# EasyEDA Pro project ProProject_OSC_Ver0.2_2023-10-09.epro

# Schematic Schematic1

## Sheets
1 Power: Create Date: 2023-09-10; Page Name: Power; Project Name: OSC_Ver0.2; Schematic Name: Schematic1; Update Date: 2023-09-19; Company: 嘉立创EDA; Page Size: A4; Version: V1.0
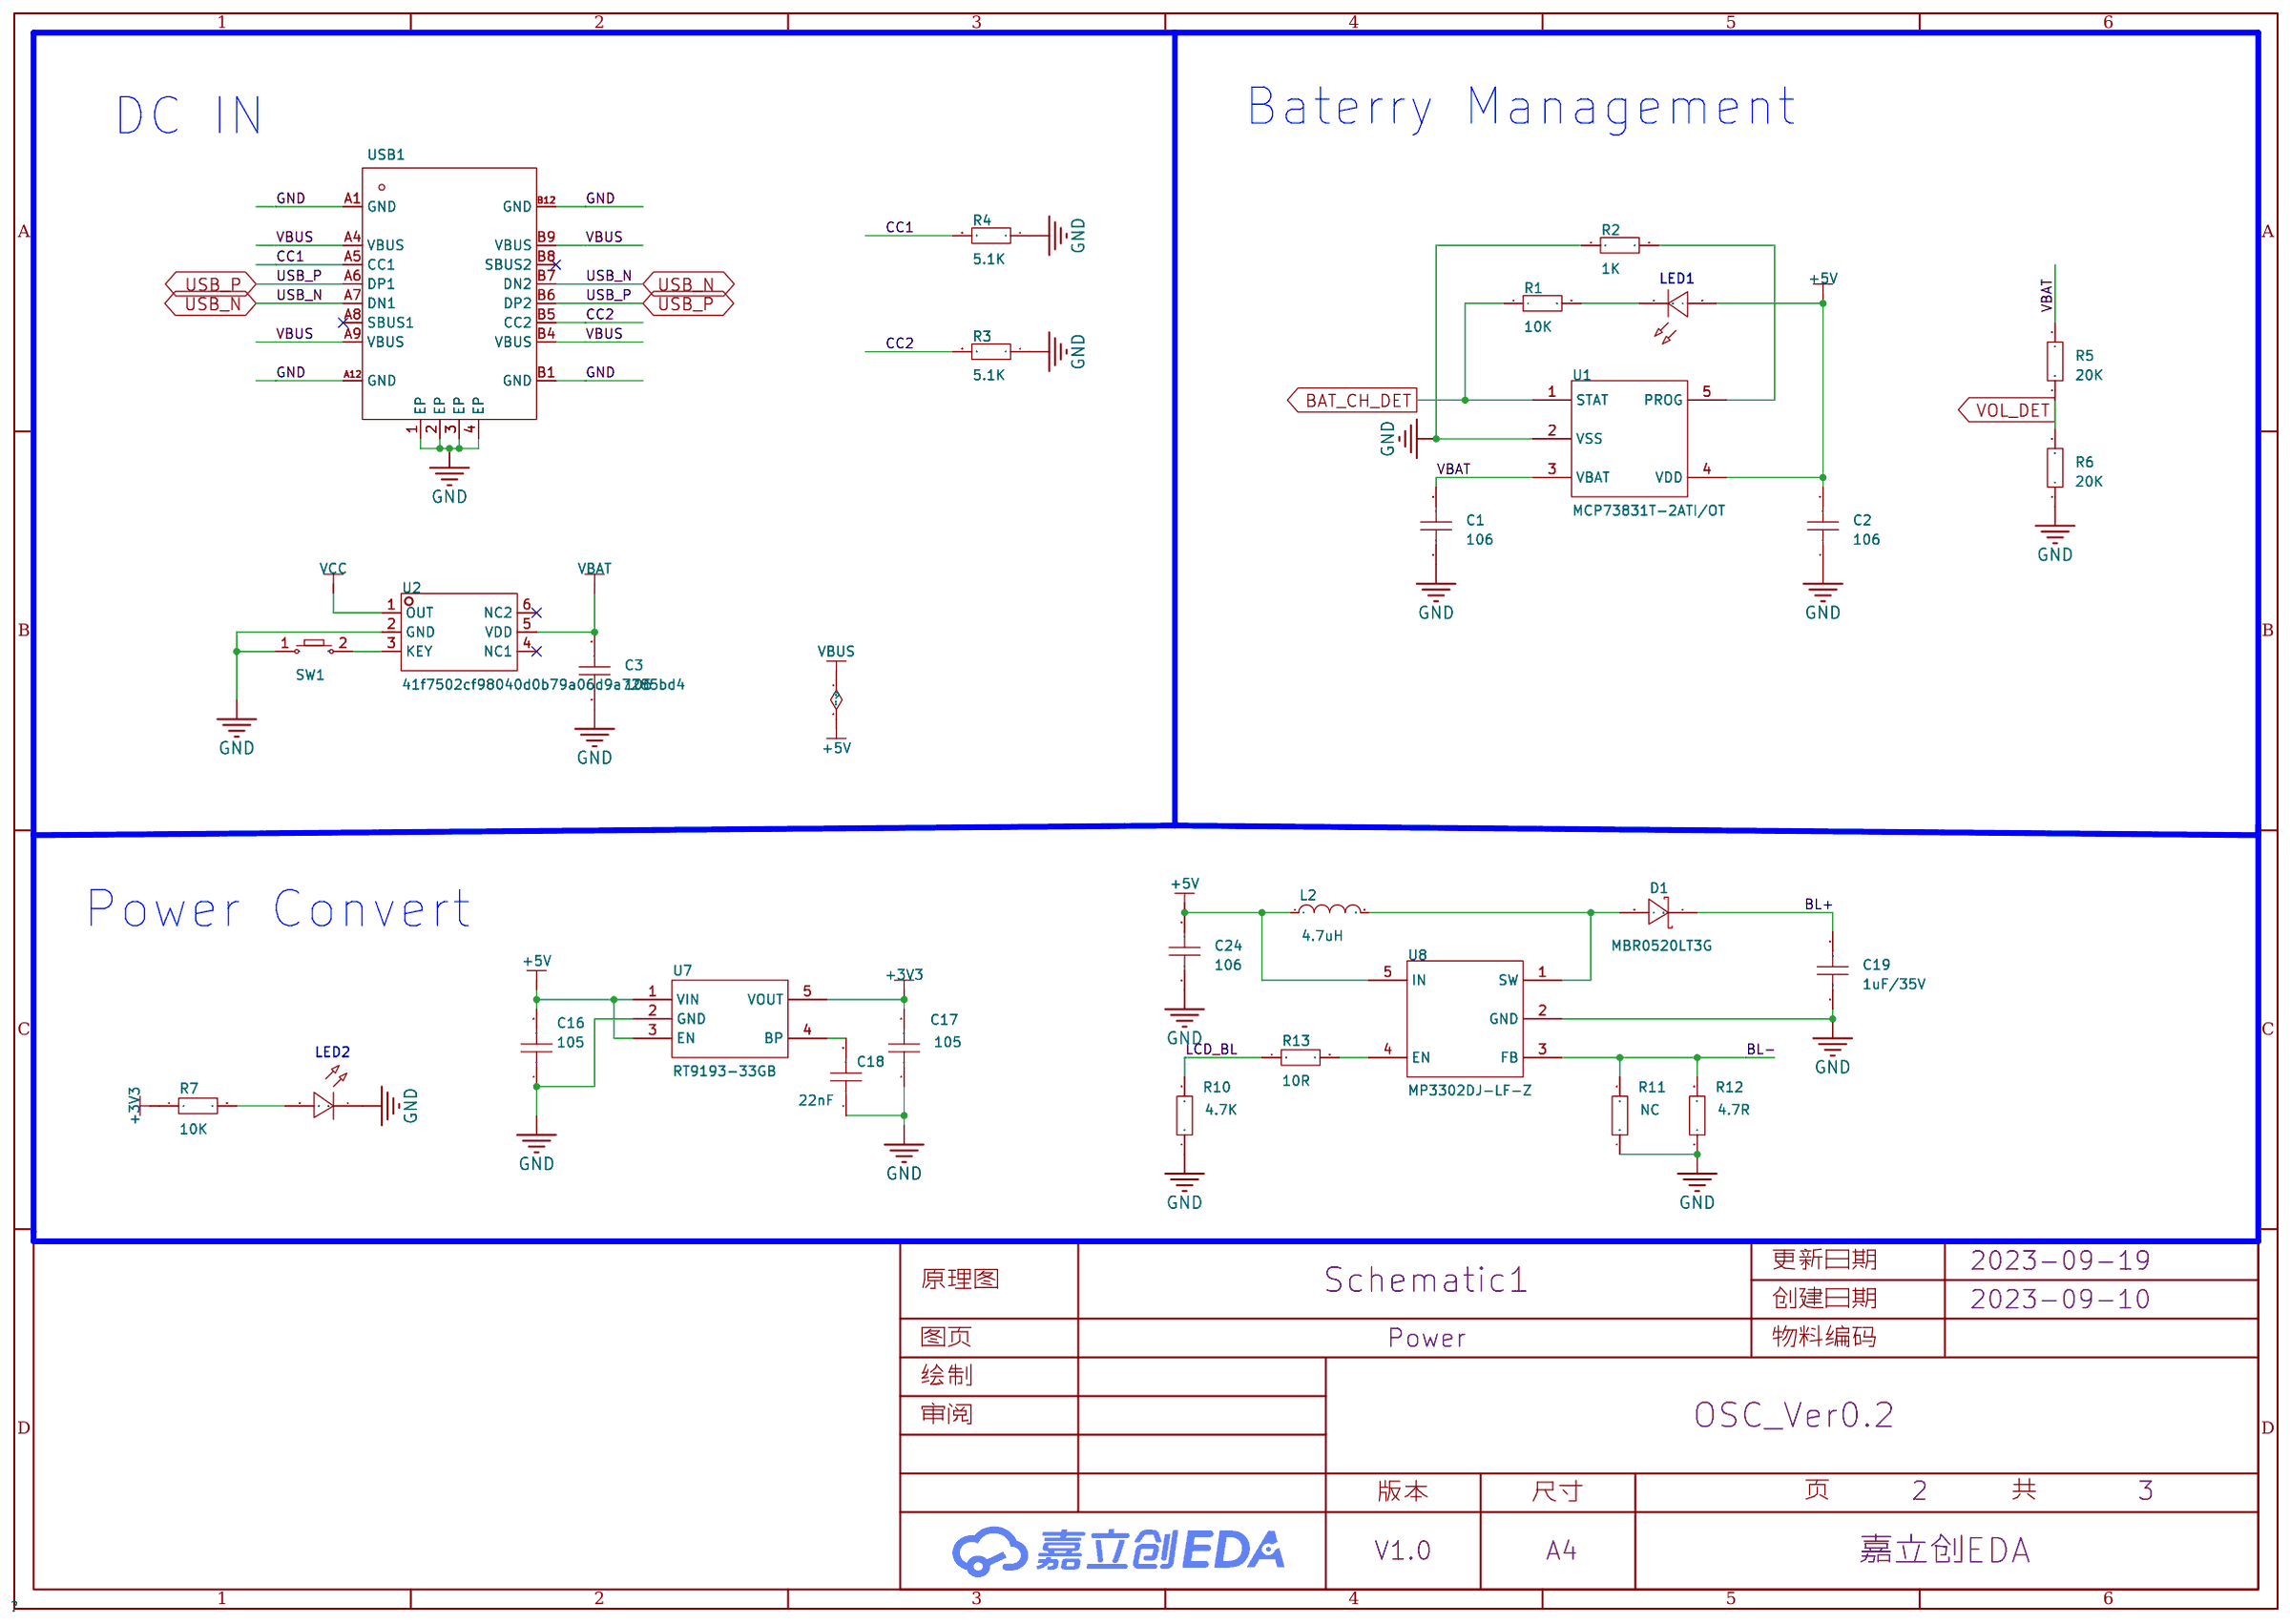
[diagram p0: Power]
2 MCU: Page Name: MCU; Update Date: 2023-10-03; Page Size: A3
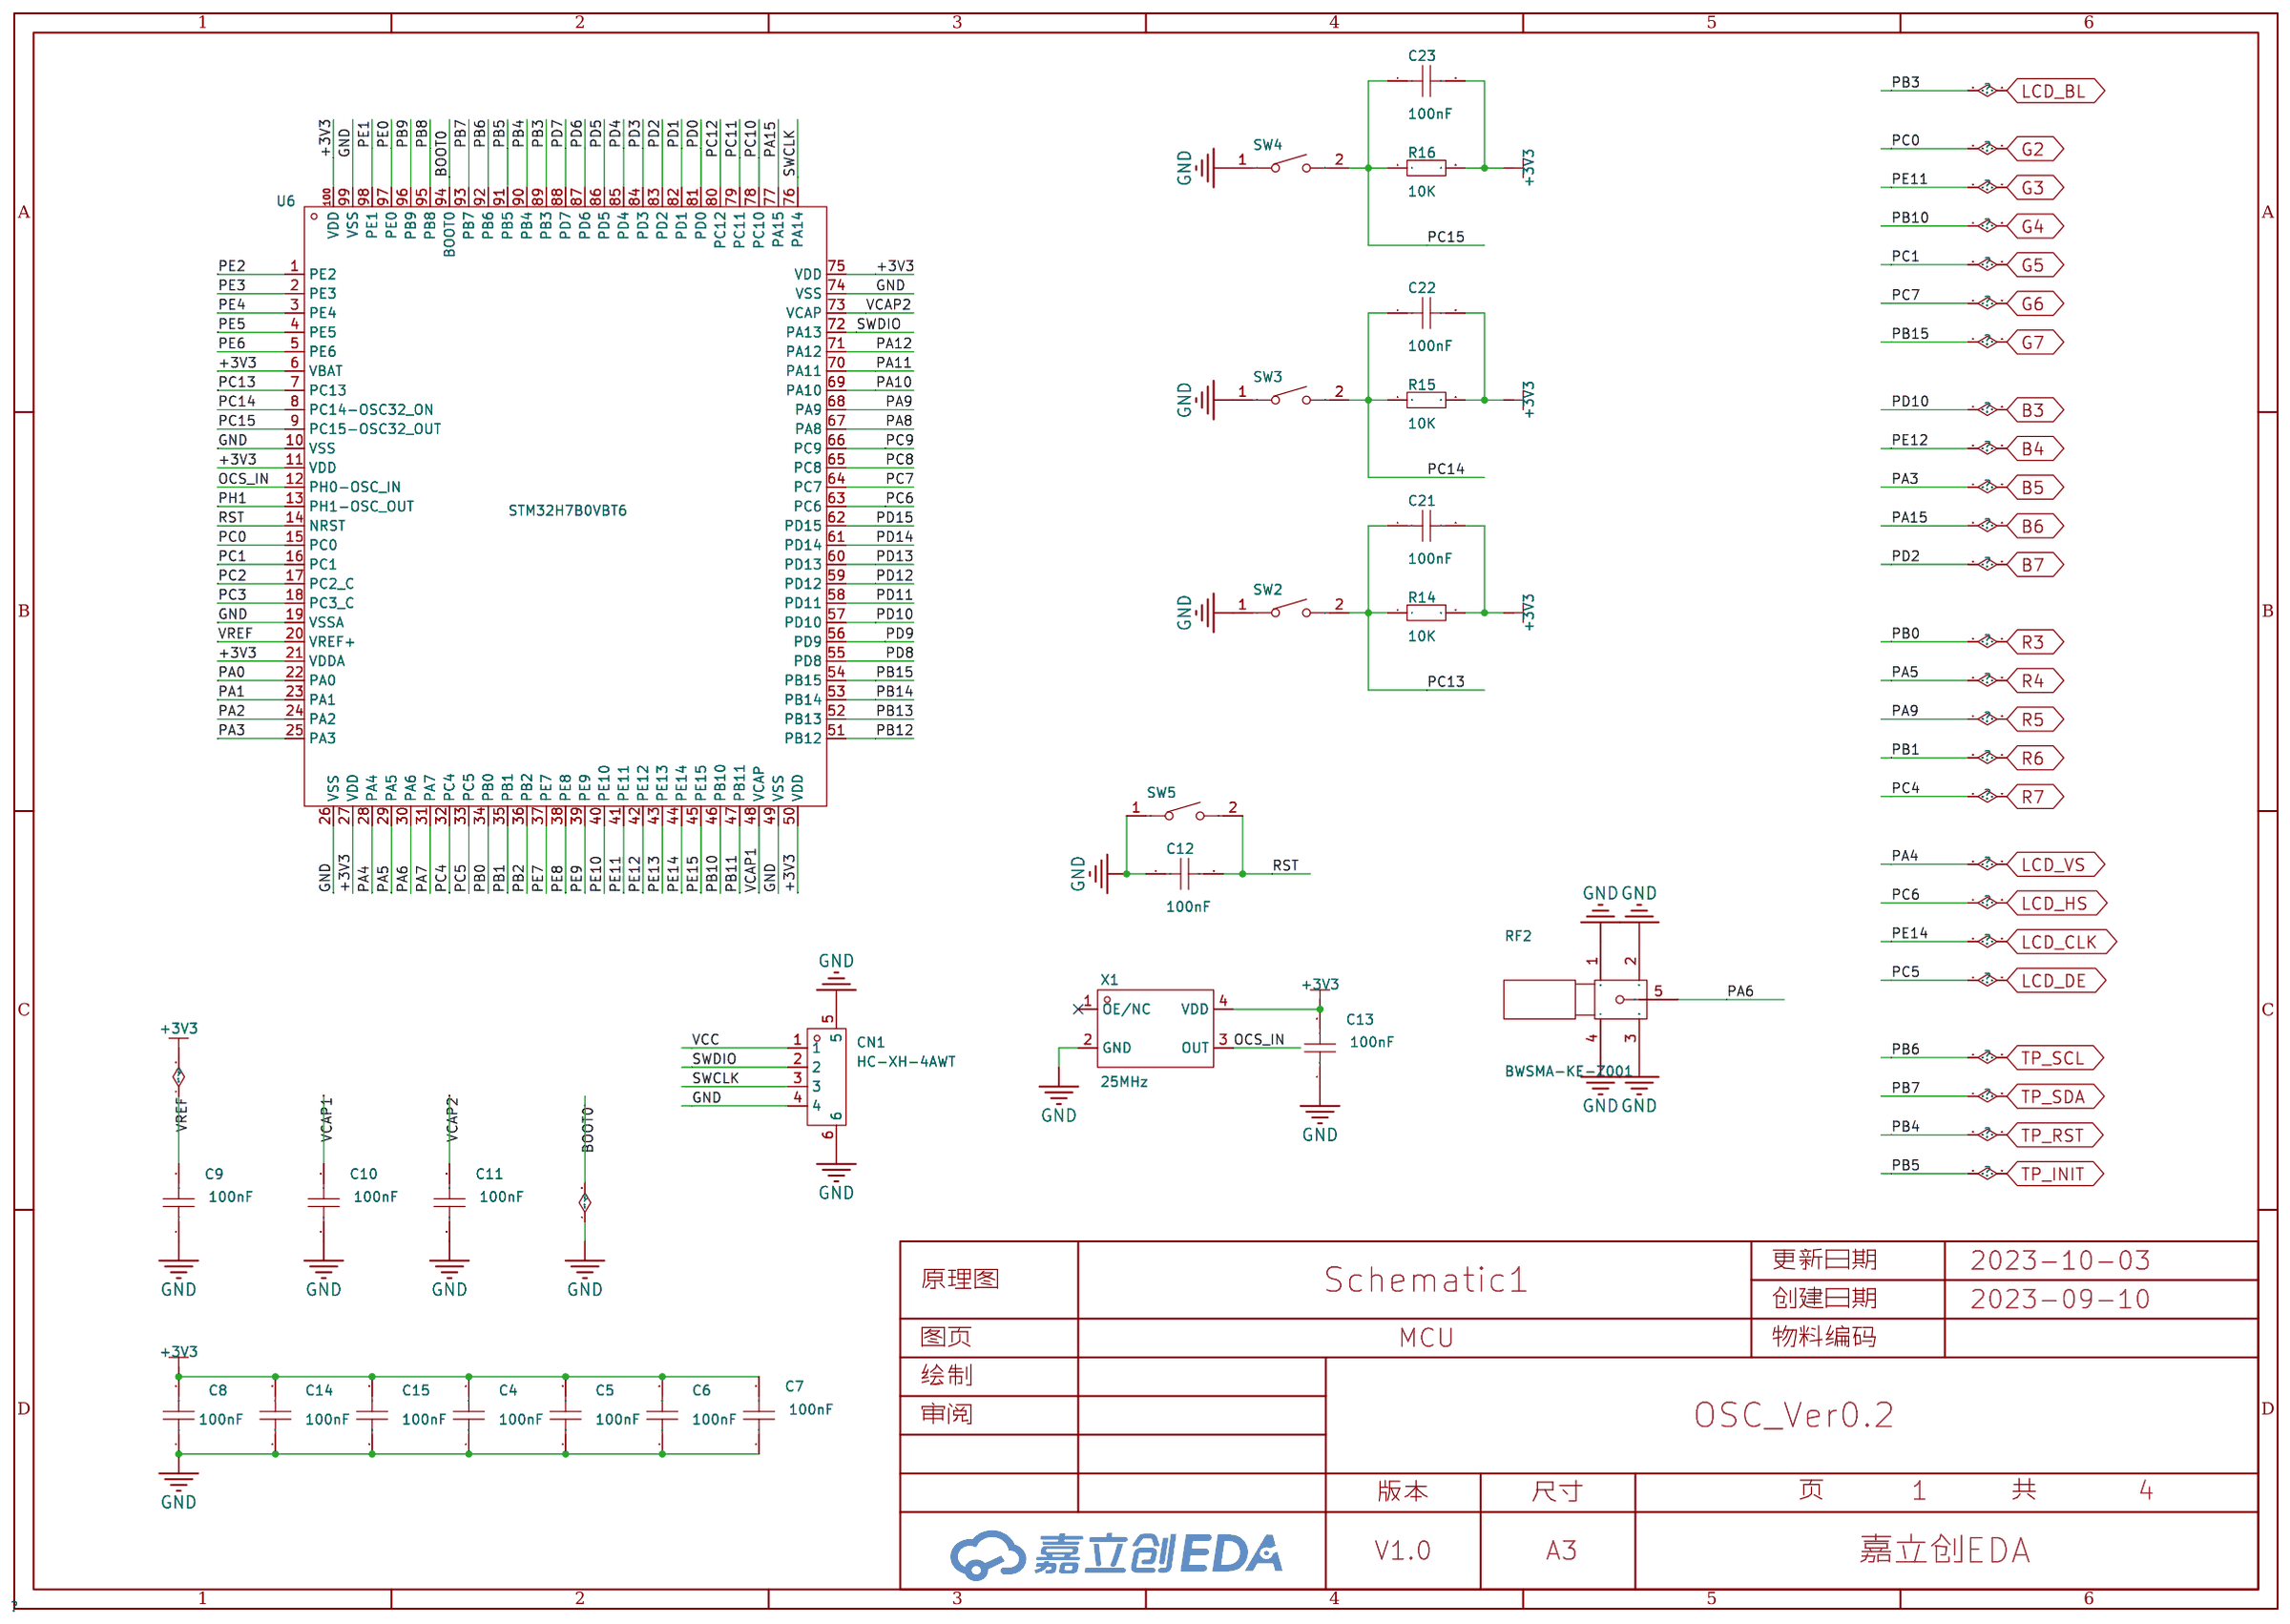
[diagram p1: MCU]
3 Screen: Create Date: 2023-09-18; Page Name: Screen; Update Date: 2023-09-18
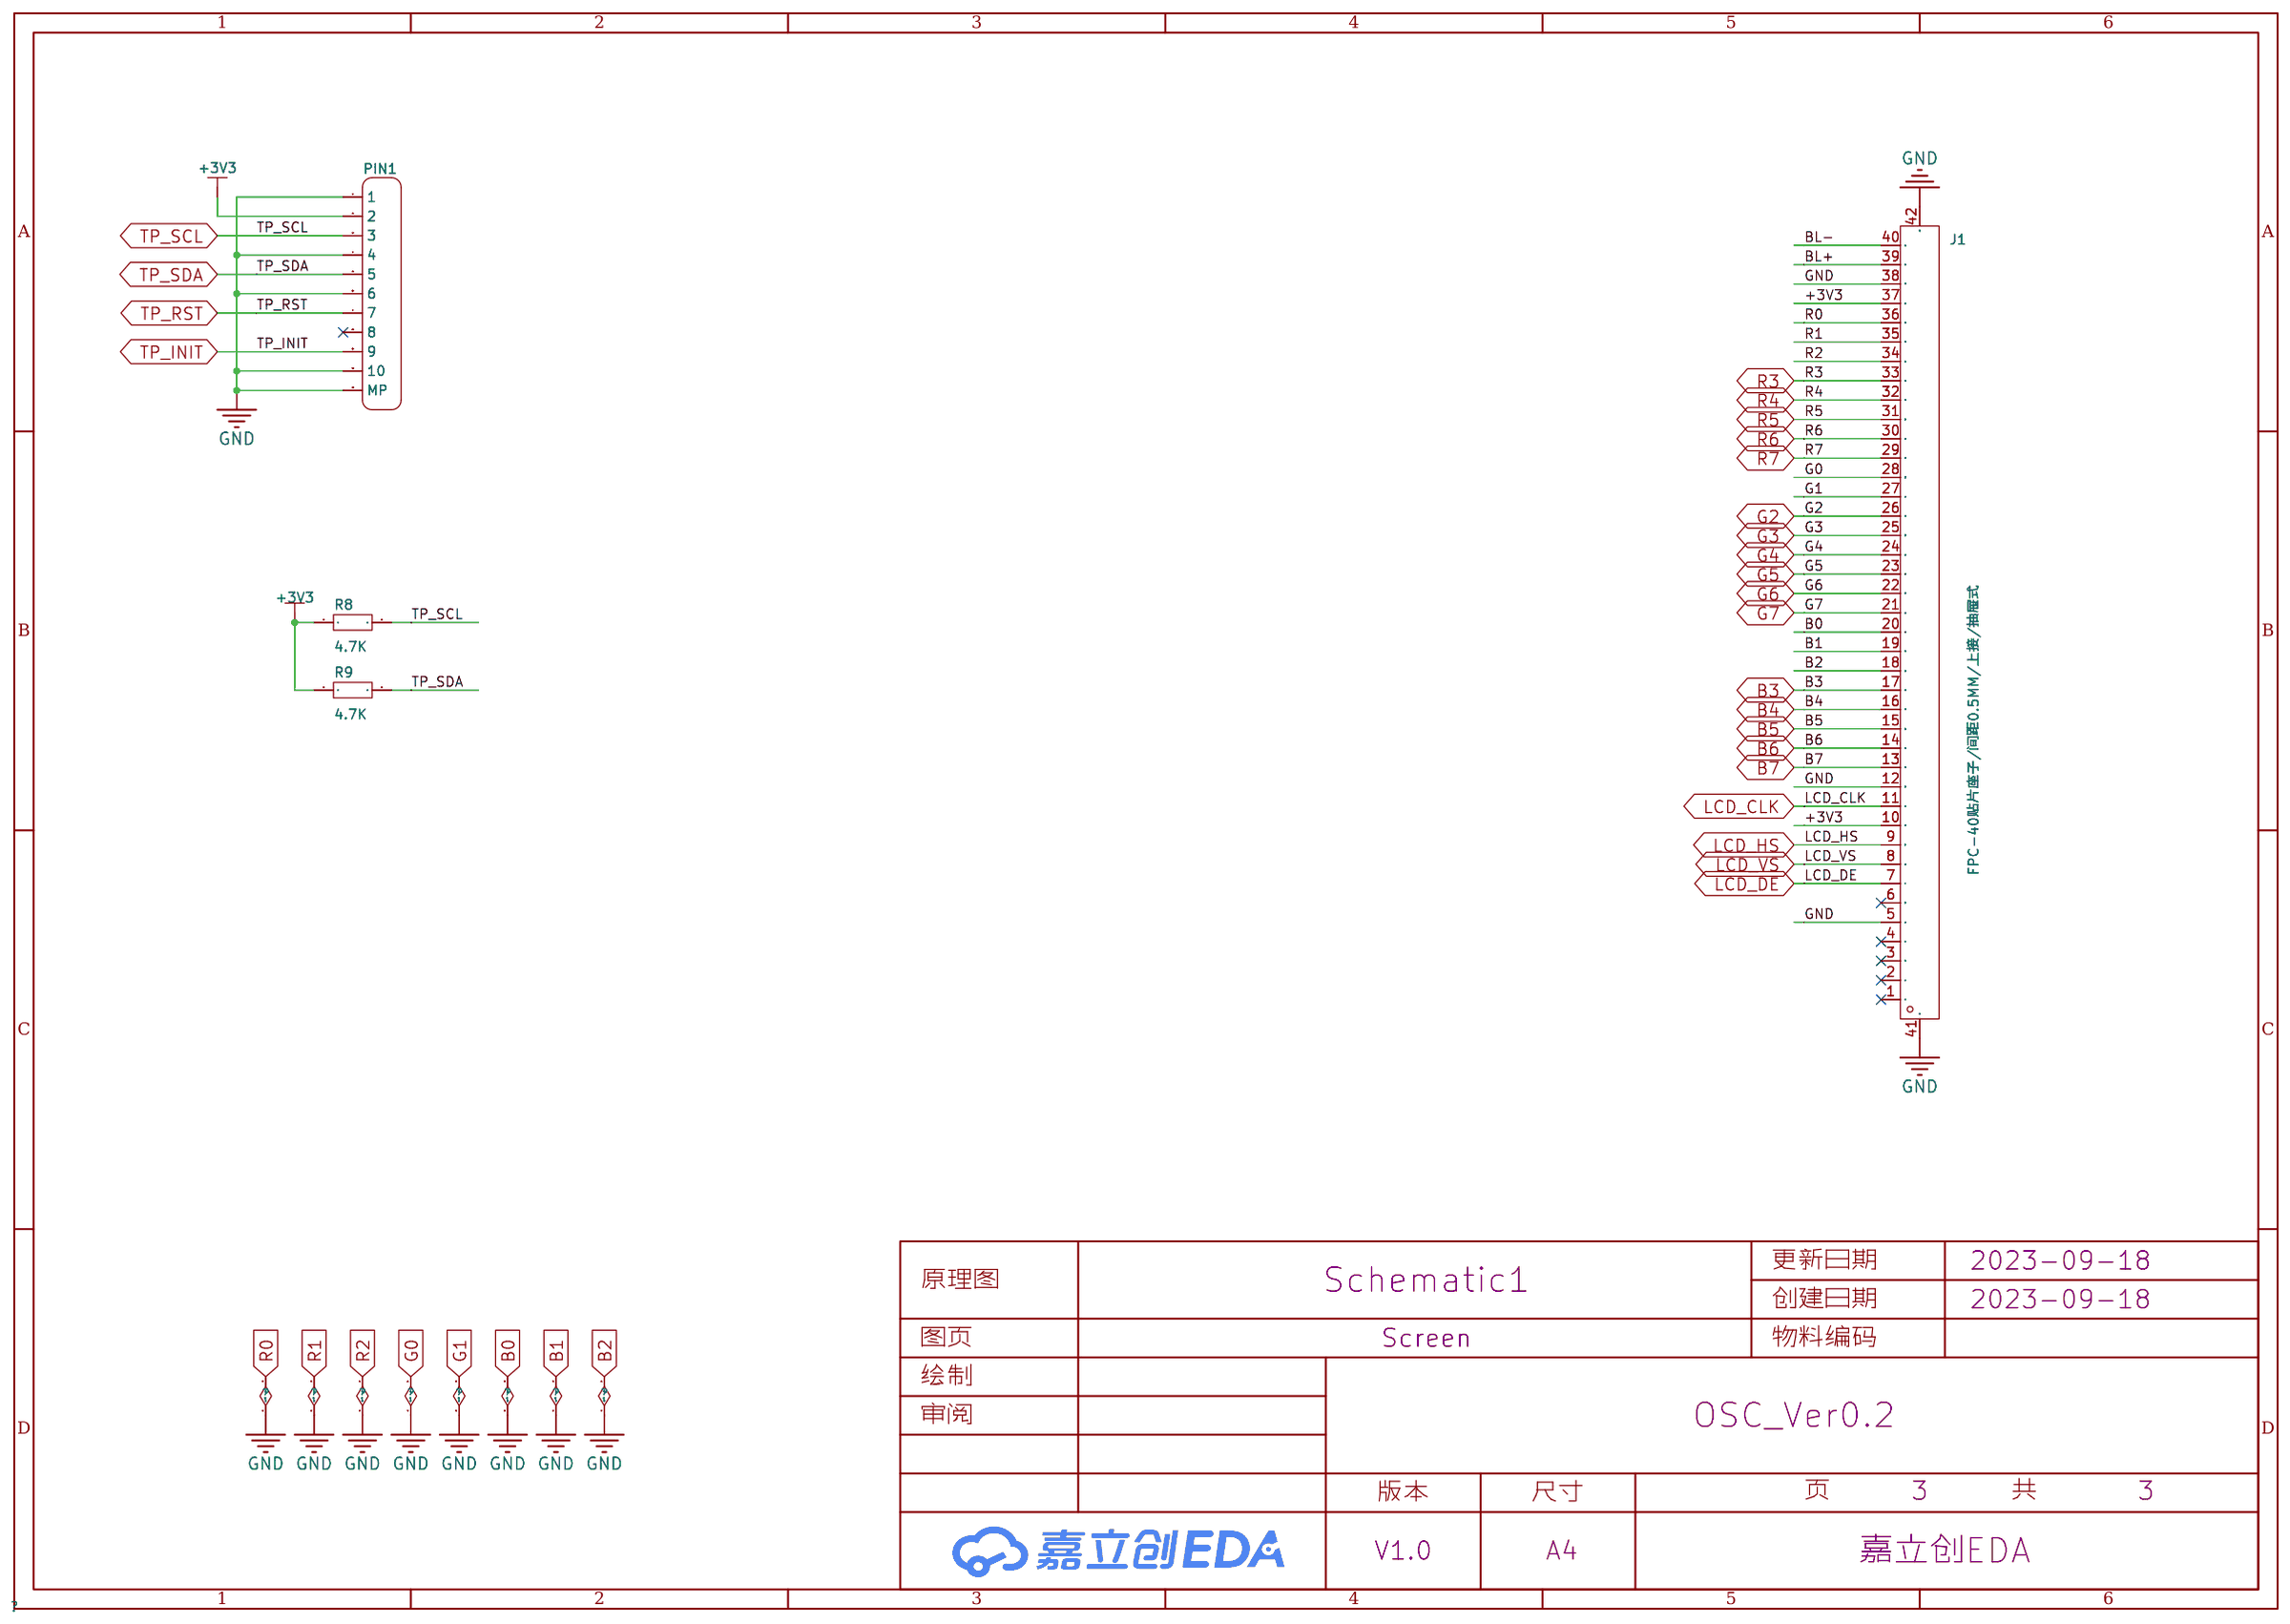
[diagram p2: Screen]
4 Analog: Create Date: 2023-10-07; Page Name: Analog.Schematic1; Update Date: 2023-10-07
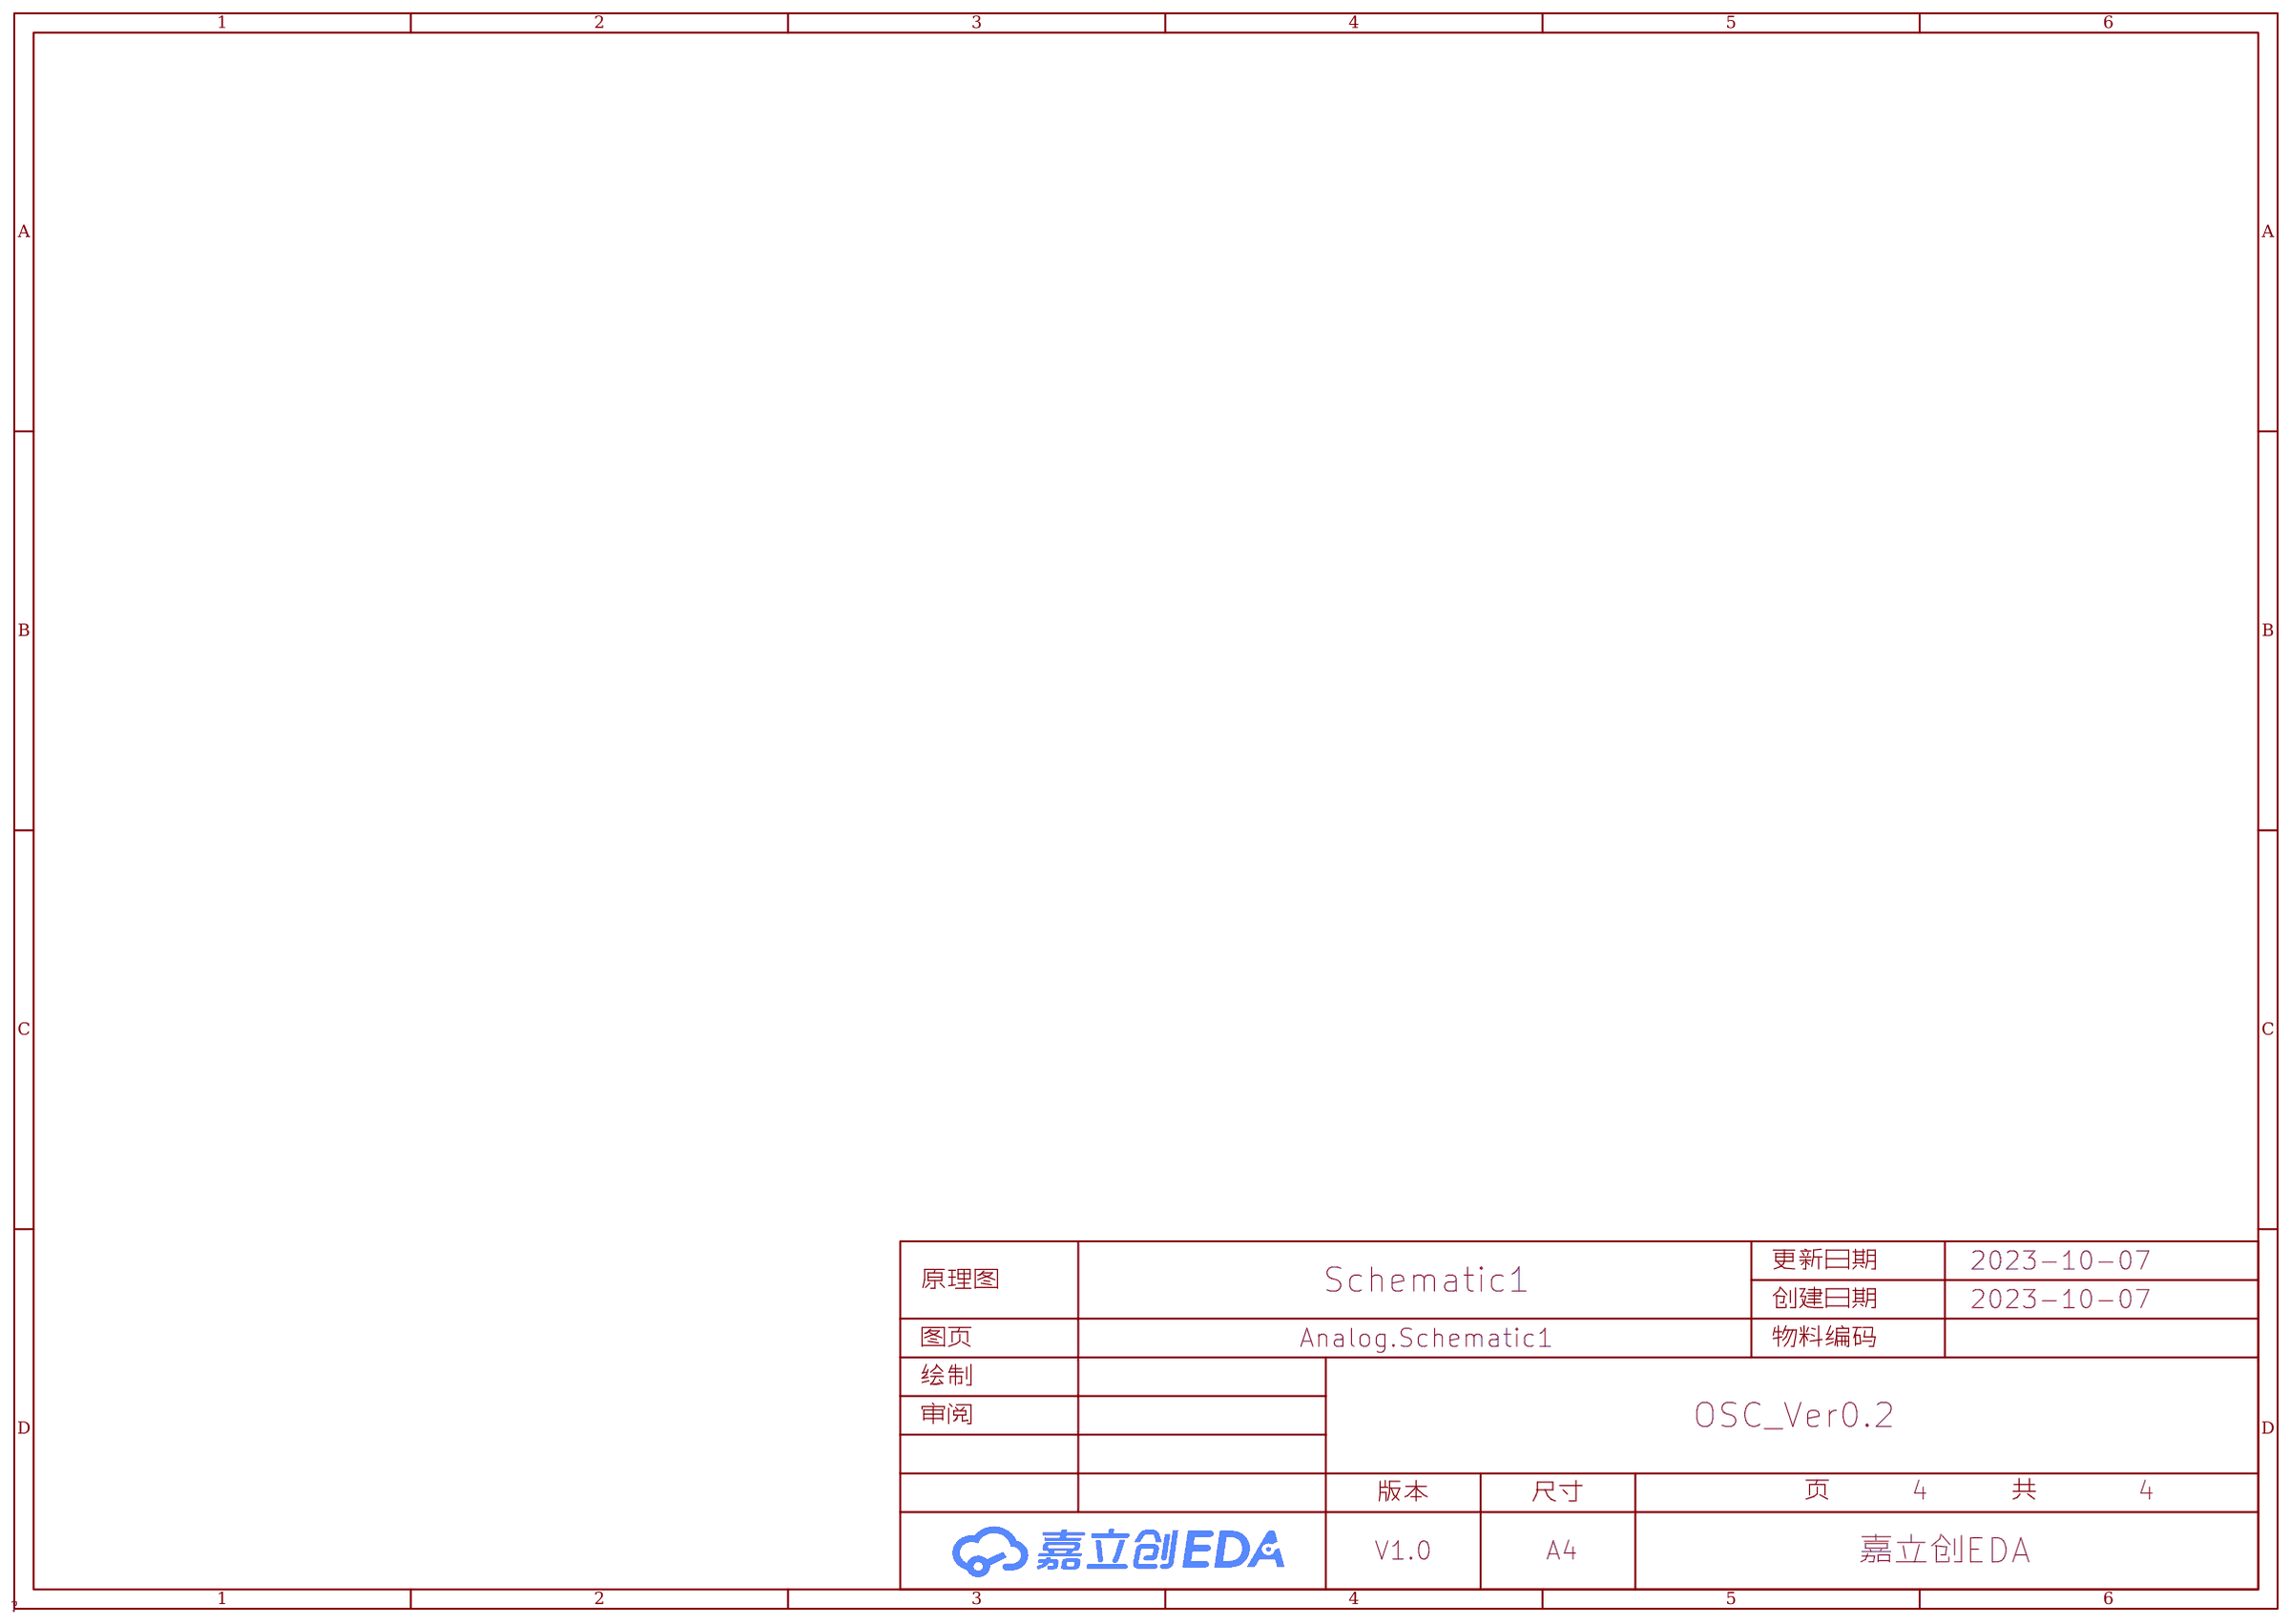
[diagram p3: Analog]

## Parts
sheet MCU
C4  100nF  [C0603]
C5  100nF  [C0603]
C6  100nF  [C0603]
C7  100nF  [C0603]
C8  100nF  [C0603]
C9  100nF  [C0603]
C10  100nF  [C0603]
C11  100nF  [C0603]
C12  100nF  [C0603]
C13  100nF  [C0603]
C14  100nF  [C0603]
C15  100nF  [C0603]
C21  100nF  [C0603]
C22  100nF  [C0603]
C23  100nF  [C0603]
CN1  HC-XH-4AWT  [CONN-SMD_HC-XH-4AWT]
R14  10K  [R0603]
R15  10K  [R0603]
R16  10K  [R0603]
RF2  BWSMA-KE-Z001  [SMA-TH_BWSMA-KE-Z001]
SW2  轻触按键3*4*H  [SW-SMD_L4.0-W2.9-LS5.0]
SW3  轻触按键3*4*H  [SW-SMD_L4.0-W2.9-LS5.0]
SW4  轻触按键3*4*H  [SW-SMD_L4.0-W2.9-LS5.0]
SW5  轻触按键3*4*H  [SW-SMD_L4.0-W2.9-LS5.0]
U6  STM32H7B0VBT6  [LQFP-100_L14.0-W14.0-P0.50-LS16.0-BL]
X1  25MHz  [OSC-SMD_4P-L3.2-W2.5-BL]
sheet Power
C1  106  [C1206]
C2  106  [C1206]
C3  106  [C1206]
C16  100nF  [C0603]
C17  100nF  [C0603]
C18  100nF  [C0603]
C19  100nF  [C0603]
C24  106  [C1206]
D1  MBR0520LT3G  [SOD-123_L2.7-W1.6-LS3.7-RD]
L2  4.7uH  [IND-SMD_L7.3-W6.6]
LED1  -  [LED_0805]
LED2  -  [LED_0805]
R1  10K  [R0603]
R2  1K  [R0603]
R3  5.1K  [R0603]
R4  5.1K  [R0603]
R5  20K  [R0603]
R6  20K  [R0603]
R7  10K  [R0603]
R10  10K  [R0603]
R11  10K  [R0603]
R12  10K  [R0603]
R13  10K  [R0603]
SW1  -  [Key_SMD_3x4x2]
U1  MCP73831T-2ATI/OT  [SOT-23-5_L3.0-W1.7-P0.95-LS2.8-BR]
U2  41f7502cf98040d0b79a06d9a7285bd4  [SOT-23-6_L2.9-W1.6-P0.95-LS2.8-TL_UPC2709]
U7  RT9193-33GB  [SOT-23-5_L3.0-W1.7-P0.95-LS2.8-BR]
U8  MP3302DJ-LF-Z  [SOT-23-5_L3.0-W1.7-P0.95-LS2.8-BR]
USB1  -  [USB_TYPE-C-16P]
sheet Screen
J1  FPC-40贴片座子/间距0.5MM/上接/抽屉式  [FPC-SMD_40P-P0.50_FPC-40-2]
PIN1  -  [Hirose_FH12-10S-0.5SH_1x10-1MP_P0.50mm_Horizontal]
R8  10K  [R0603]
R9  10K  [R0603]

## Library data of the parts
C4-C19 C21-C23 = CAP_0603: Supplier Footprint: 0603
CN1 = HC-XH-4AWT: 参考系列:-;间距:2.5mm;插针结构:1x4P;排数:1;每排PIN数:4;行距:-;公母:公型插针;安装方式:卧贴;额定电流:3A;工作温度范围:-25℃~+85℃;; LCSC Part Name: 4P卧贴间距P=2.5mm; Supplier Part: C2845685; Manufacturer: HCTL(华灿天禄); Supplier Footprint: SMD,P=2.5mm; JLCPCB Part Class: ExtendedPart; Datasheet: https://atta.szlcsc.com/upload/public/pdf/source/20210728/C2845684_965343274C5A1ED3FF00B3B6BCC0A9E5.pdf; Supplier: LCSC; Pitch: 2.5mm; Pins Structure: 1x4P; Number of Rows: 1; Number of PINs Per Row: 4; Gender: 公型插针; Mounting Style: 卧贴; Current Rating (Max): 3A; Operating Temperature Range: -25℃~+85℃
R1-R16 = Res_0603: Supplier Footprint: 0603
RF2 = BWSMA-KE-Z001_C496549: 连接器类型:板端;射频系列:SMA;接口类型:内孔;端口数量:1;阻抗:50Ω;频率-最大值:12.4GHz;样式:正脚;接口直径:-;接口长度/高度:-;工作温度范围:-65℃~+165℃;; LCSC Part Name: SMA 内孔 正脚 SMA直头正脚板端座子; Supplier Part: C496549; Manufacturer: BAT WIRELESS(蝙蝠无线); Supplier Footprint: 插件; JLCPCB Part Class: Extended Part; Datasheet: https://atta.szlcsc.com/upload/public/pdf/source/20200416/C496549_767995352B6C9E98F20D658FDC70347F.pdf; Supplier: LCSC; Connector Type: 板端; RF Series: SMA; Interface Type: 内孔; Number of Ports: 1; Impedance: 50Ω; Frequency-Max: 12.4GHz; Style: 正脚; Operating Temperature Range: -65℃~+165℃
SW2-SW5 = 轻触按键3*4*H: Supplier Part: C9900017573; Supplier Footprint: 轻触按键3*4*2.5; JLCPCB Part Class: Extended Part; Datasheet: https://atta.szlcsc.comnull; Supplier: LCSC
U6 = STM32H7B0VBT6: CPU位数:-;ROM类型:-;CPU内核:-;主频（MAX):-;工作电压:-;; Supplier Part: C730227; Manufacturer: ST(意法半导体); Supplier Footprint: LQFP-100; JLCPCB Part Class: Extended Part; Datasheet: https://atta.szlcsc.com/upload/public/pdf/source/20200902/C730225_664883C886B4E760FDC927233147DBDC.pdf; Supplier: LCSC
X1 = CO32H4-25.000-33JDTSN: 频率:25MHz;频率稳定度:±30ppm;工作电压:3.3V;输出模式:HCMOS;工作温度:-40~+85;; LCSC Part Name: 25MHz ±30ppm 3.3V HCMOS; Supplier Part: C2925590; Manufacturer: HCI(杭晶); Supplier Footprint: SMD3225-4P; JLCPCB Part Class: Extended Part; Datasheet: https://atta.szlcsc.com/upload/public/pdf/source/20220525/B926948FC129C170F991EA6FAC6092C6.pdf; Supplier: LCSC; Frequency Stability: ±30ppm; Supply Voltage: 3.3V; Output Type: HCMOS; Operating Temperature: -40~+85
C1-C3 C24 = CAP_1206: Supplier Footprint: 1206
D1 = MBR0520LT3G: 直流反向耐压(Vr):20V;平均整流电流(Io):500mA;正向压降(Vf):385mV@500mA;; Supplier Part: C165467; Manufacturer: onsemi(安森美); Supplier Footprint: SOD-123; JLCPCB Part Class: Extended Part; Datasheet: https://atta.szlcsc.com/upload/public/pdf/source/20200107/C165467_B46770004CC25E9EEC451D5DBE275EFE.pdf; Supplier: LCSC; Reverse Voltage (Vr): 20V; Average Rectified Current (Io): 500mA; Forward Voltage (Vf@If): 385mV@500mA
L2 = MCS0630-2R2MPY1: 电感值:2.2uH;精度:±20%;额定电流:8A;饱和电流(Isat):12A;直流电阻(DCR):17mΩ;; LCSC Part Name: 2.2uH ±20% 8A 17mΩ; Supplier Part: C2937096; Manufacturer: PSA(信昌电陶); Supplier Footprint: 0630; JLCPCB Part Class: Extended Part; Datasheet: https://atta.szlcsc.com/upload/public/pdf/source/20220121/EA6E6E6F70ED7BAE67EC293805EAAACB.pdf; Supplier: LCSC; Tolerance: ±20%; Rated Current: 8A; Saturation Current (Isat): 12A; DC Resistance (DCR): 17mΩ
LED1 LED2 = LED_0805-G: Supplier Footprint: 0805
SW1 = Key_SMD_3x4x2: Supplier Footprint: SMD
U1 = MCP73831T-2ATI/OT: Tiny 500mA linear charge management controller.  Includes integrated pass transistor, integrated current sensing, and reverse discharge protection in 5-pin SOT-23 and thermally-efficient 8-pin 2mm x 3mm DFN packages; Supplier Part: C14879; Manufacturer: MICROCHIP(美国微芯); Supplier Footprint: SOT-23-5; JLCPCB Part Class: 扩展库; Datasheet: https://atta.szlcsc.com/upload/public/pdf/source/20140724/1457707158941.pdf; Supplier: LCSC
U2 = EC190708: 长按3秒开关机
U7 = RT9193-18GB: 输出类型:固定;输出极性:正;输出通道数:1;最大输入电压:5.5V;输出电压:1.8V~1.8V;压差:-;输出电流:300mA;电源纹波抑制比(PRSS):70dB@(100Hz),50dB@(10kHz);; LCSC Part Name: Vin=5.5V Vout=1.8V~1.8V 300mA 70dB@(100Hz),50dB@(10kHz); Supplier Part: C27416; Manufacturer: RICHTEK(台湾立锜); Supplier Footprint: SOT-23-5; JLCPCB Part Class: Extended Part; Datasheet: https://atta.szlcsc.com/upload/public/pdf/source/20140319/1457707024880.pdf; Supplier: LCSC; Output Type: 固定; Output Polarity: 正; Number of Outputs: 1; Maximum Input Voltage: 5.5V; Output Voltage: 1.8V~1.8V; Output Current: 300mA; Power Supply Rejection Ratio (PRSS): 70dB@(100Hz),50dB@(10kHz)
U8 = MP3302DJ-LF-Z: Supplier Part: C15035; Supplier Footprint: SOT-23-5; JLCPCB Part Class: Extended Part; Supplier: LCSC
USB1 = USB_TYPE-C-16P: Supplier Footprint: SMD
J1 = FPC-40贴片座子/间距0.5MM/上接/抽屉式: Supplier Part: C9900017908; Supplier Footprint: FPC-SMD-40P; JLCPCB Part Class: Extended Part; Datasheet: https://atta.szlcsc.comnull; Supplier: LCSC
PIN1 = FPC_10P_P0.50

## Nets
+3V3: C4.2 C5.2 C6.2 C7.2 C8.2 C9.2 C13.2 C14.2 C15.2 C17.2 C21.2 C22.2 C23.2 J1.10 J1.37 PIN1.2 R7.1 R8.1 R9.1 R14.2 R15.2 R16.2 U6.6(VBAT) U6.11(VDD) U6.20(VREF+) U6.21(VDDA) U6.27(VDD) U6.50(VDD) U6.75(VDD) U6.100(VDD) U7.5(VOUT) X1.4(VDD)
+5V: C2.2 C16.2 C24.2 L2.1 LED1.2(A) U1.4(VDD) U7.1(VIN) U7.3(EN) U8.5(IN) USB1.A4(VBUS) USB1.A9(VBUS) USB1.B4(VBUS) USB1.B9(VBUS)
GND: C1.1 C2.1 C3.1 C4.1 C5.1 C6.1 C7.1 C8.1 C9.1 C10.1 C11.1 C12.1 C13.1 C14.1 C15.1 C16.1 C17.1 C18.1 C19.1 C24.1 CN1.4 CN1.5 CN1.6 J1.5 J1.12 J1.18 J1.19 J1.20 J1.27 J1.28 J1.34 J1.35 J1.36 J1.38 J1.41 J1.42 LED2.1(C) PIN1.1 PIN1.4 PIN1.6 PIN1.10 PIN1.MP R2.1 R3.1 R4.1 R6.1 R10.1 R11.1 R12.1 RF2.1 RF2.2 RF2.3 RF2.4 SW1.1 SW2.1 SW3.1 SW4.1 SW5.1 U1.2(VSS) U2.2(GND) U6.10(VSS) U6.19(VSSA) U6.26(VSS) U6.49(VSS) U6.74(VSS) U6.94(BOOT0) U6.99(VSS) U7.2(GND) U8.2(GND) USB1.1(EP) USB1.2(EP) USB1.3(EP) USB1.4(EP) USB1.A1(GND) USB1.A12(GND) USB1.B1(GND) USB1.B12(GND) X1.2(GND)
VBAT: C1.2 C3.2 R5.2 U1.3(VBAT) U2.5(VDD)
VCC: CN1.1 U2.1(OUT)
B3: J1.17 U6.57(PD10)
B4: J1.16 U6.42(PE12)
B5: J1.15 U6.25(PA3)
B6: J1.14 U6.77(PA15)
B7: J1.13 U6.83(PD2)
BAT_CH_DET: R1.1 U1.1(STAT)
BL+: C19.2 D1.1(C) J1.39
BL-: J1.40 R11.2 R12.2 U8.3(FB)
CC1: R4.2 USB1.A5(CC1)
CC2: R3.2 USB1.B5(CC2)
G2: J1.26 U6.15(PC0)
G3: J1.25 U6.41(PE11)
G4: J1.24 U6.46(PB10)
G5: J1.23 U6.16(PC1)
G6: J1.22 U6.64(PC7)
G7: J1.21 U6.54(PB15)
LCD_BL: R10.2 R13.1 U6.89(PB3)
LCD_CLK: J1.11 U6.44(PE14)
LCD_DE: J1.7 U6.33(PC5)
LCD_HS: J1.9 U6.63(PC6)
LCD_VS: J1.8 U6.28(PA4)
OCS_IN: U6.12(PH0-OSC_IN) X1.3(OUT)
PA0: U6.22(PA0)
PA1: U6.23(PA1)
PA2: U6.24(PA2)
PA5: J1.32 U6.29(PA5)
PA6: RF2.5 U6.30(PA6)
PA7: U6.31(PA7)
PA8: U6.67(PA8)
PA9: J1.31 U6.68(PA9)
PA10: U6.69(PA10)
PA11: U6.70(PA11)
PA12: U6.71(PA12)
PB0: J1.33 U6.34(PB0)
PB1: J1.30 U6.35(PB1)
PB2: U6.36(PB2)
PB4: PIN1.7 U6.90(PB4)
PB5: PIN1.9 U6.91(PB5)
PB6: PIN1.3 R8.2 U6.92(PB6)
PB7: PIN1.5 R9.2 U6.93(PB7)
PB8: U6.95(PB8)
PB9: U6.96(PB9)
PB11: U6.47(PB11)
PB12: U6.51(PB12)
PB13: U6.52(PB13)
PB14: U6.53(PB14)
PC2: U6.17(PC2_C)
PC3: U6.18(PC3_C)
PC4: J1.29 U6.32(PC4)
PC8: U6.65(PC8)
PC9: U6.66(PC9)
PC10: U6.78(PC10)
PC11: U6.79(PC11)
PC12: U6.80(PC12)
PC13: C21.1 R14.1 SW2.2 U6.7(PC13)
PC14: C22.1 R15.1 SW3.2 U6.8(PC14-OSC32_ON)
PC15: C23.1 R16.1 SW4.2 U6.9(PC15-OSC32_OUT)
PD0: U6.81(PD0)
PD1: U6.82(PD1)
PD3: U6.84(PD3)
PD4: U6.85(PD4)
PD5: U6.86(PD5)
PD6: U6.87(PD6)
PD7: U6.88(PD7)
PD8: U6.55(PD8)
PD9: U6.56(PD9)
PD11: U6.58(PD11)
PD12: U6.59(PD12)
PD13: U6.60(PD13)
PD14: U6.61(PD14)
PD15: U6.62(PD15)
PE0: U6.97(PE0)
PE1: U6.98(PE1)
PE2: U6.1(PE2)
PE3: U6.2(PE3)
PE4: U6.3(PE4)
PE5: U6.4(PE5)
PE6: U6.5(PE6)
PE7: U6.37(PE7)
PE8: U6.38(PE8)
PE9: U6.39(PE9)
PE10: U6.40(PE10)
PE13: U6.43(PE13)
PE15: U6.45(PE15)
PH1: U6.13(PH1-OSC_OUT)
RST: C12.2 SW5.2 U6.14(NRST)
SWCLK: CN1.3 U6.76(PA14)
SWDIO: CN1.2 U6.72(PA13)
USB_N: USB1.A7(DN1) USB1.B7(DN2)
USB_P: USB1.A6(DP1) USB1.B6(DP2)
VCAP1: C10.2 U6.48(VCAP)
VCAP2: C11.2 U6.73(VCAP)
VOL_DET: R5.1 R6.2
$1N2047: C18.2 U7.4(BP)
$1N2420: D1.2(A) L2.2 U8.1(SW)
$1N2425: R13.2 U8.4(EN)
Net-(LED1-1): LED1.1(C) R1.2
Net-(LED2-2): LED2.2(A) R7.2
Net-(R2-2): R2.2 U1.5(PROG)
Net-(SW1-2): SW1.2 U2.3(KEY)

Not connected (* = marked no-connect by the designer): J1 1* 2* 3* 4* 6*; PIN1 8*; U2 4(NC1)* 6(NC2)*; USB1 A8(SBUS1)* B8(SBUS2)*; X1 1(OE/NC)*

## Notes on the sheets
sheet 1
- Baterry Management
- DC IN
- Power Convert

# Board PCB1
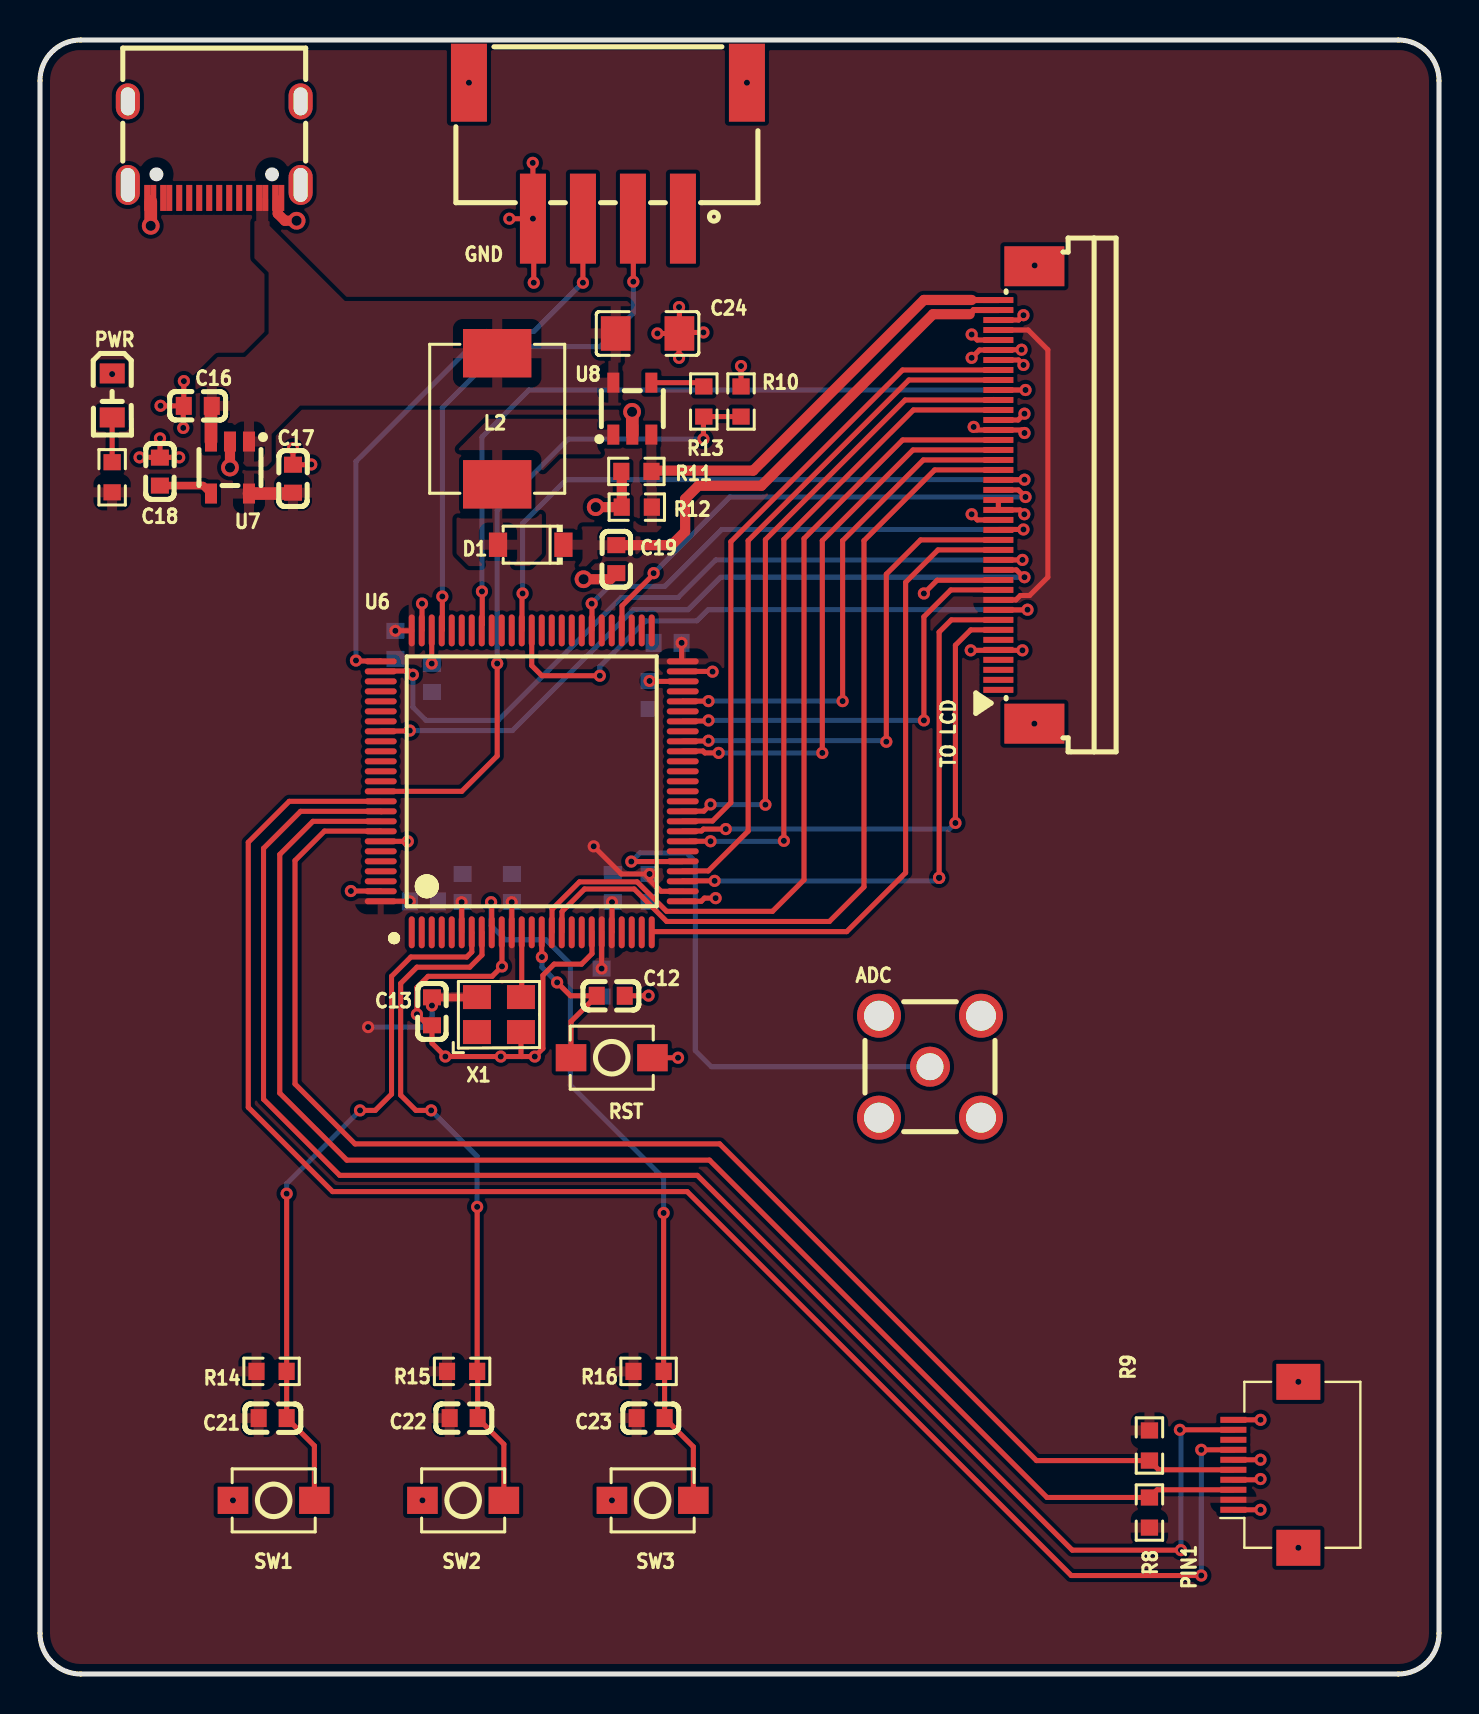
[diagram p4: board, top side]
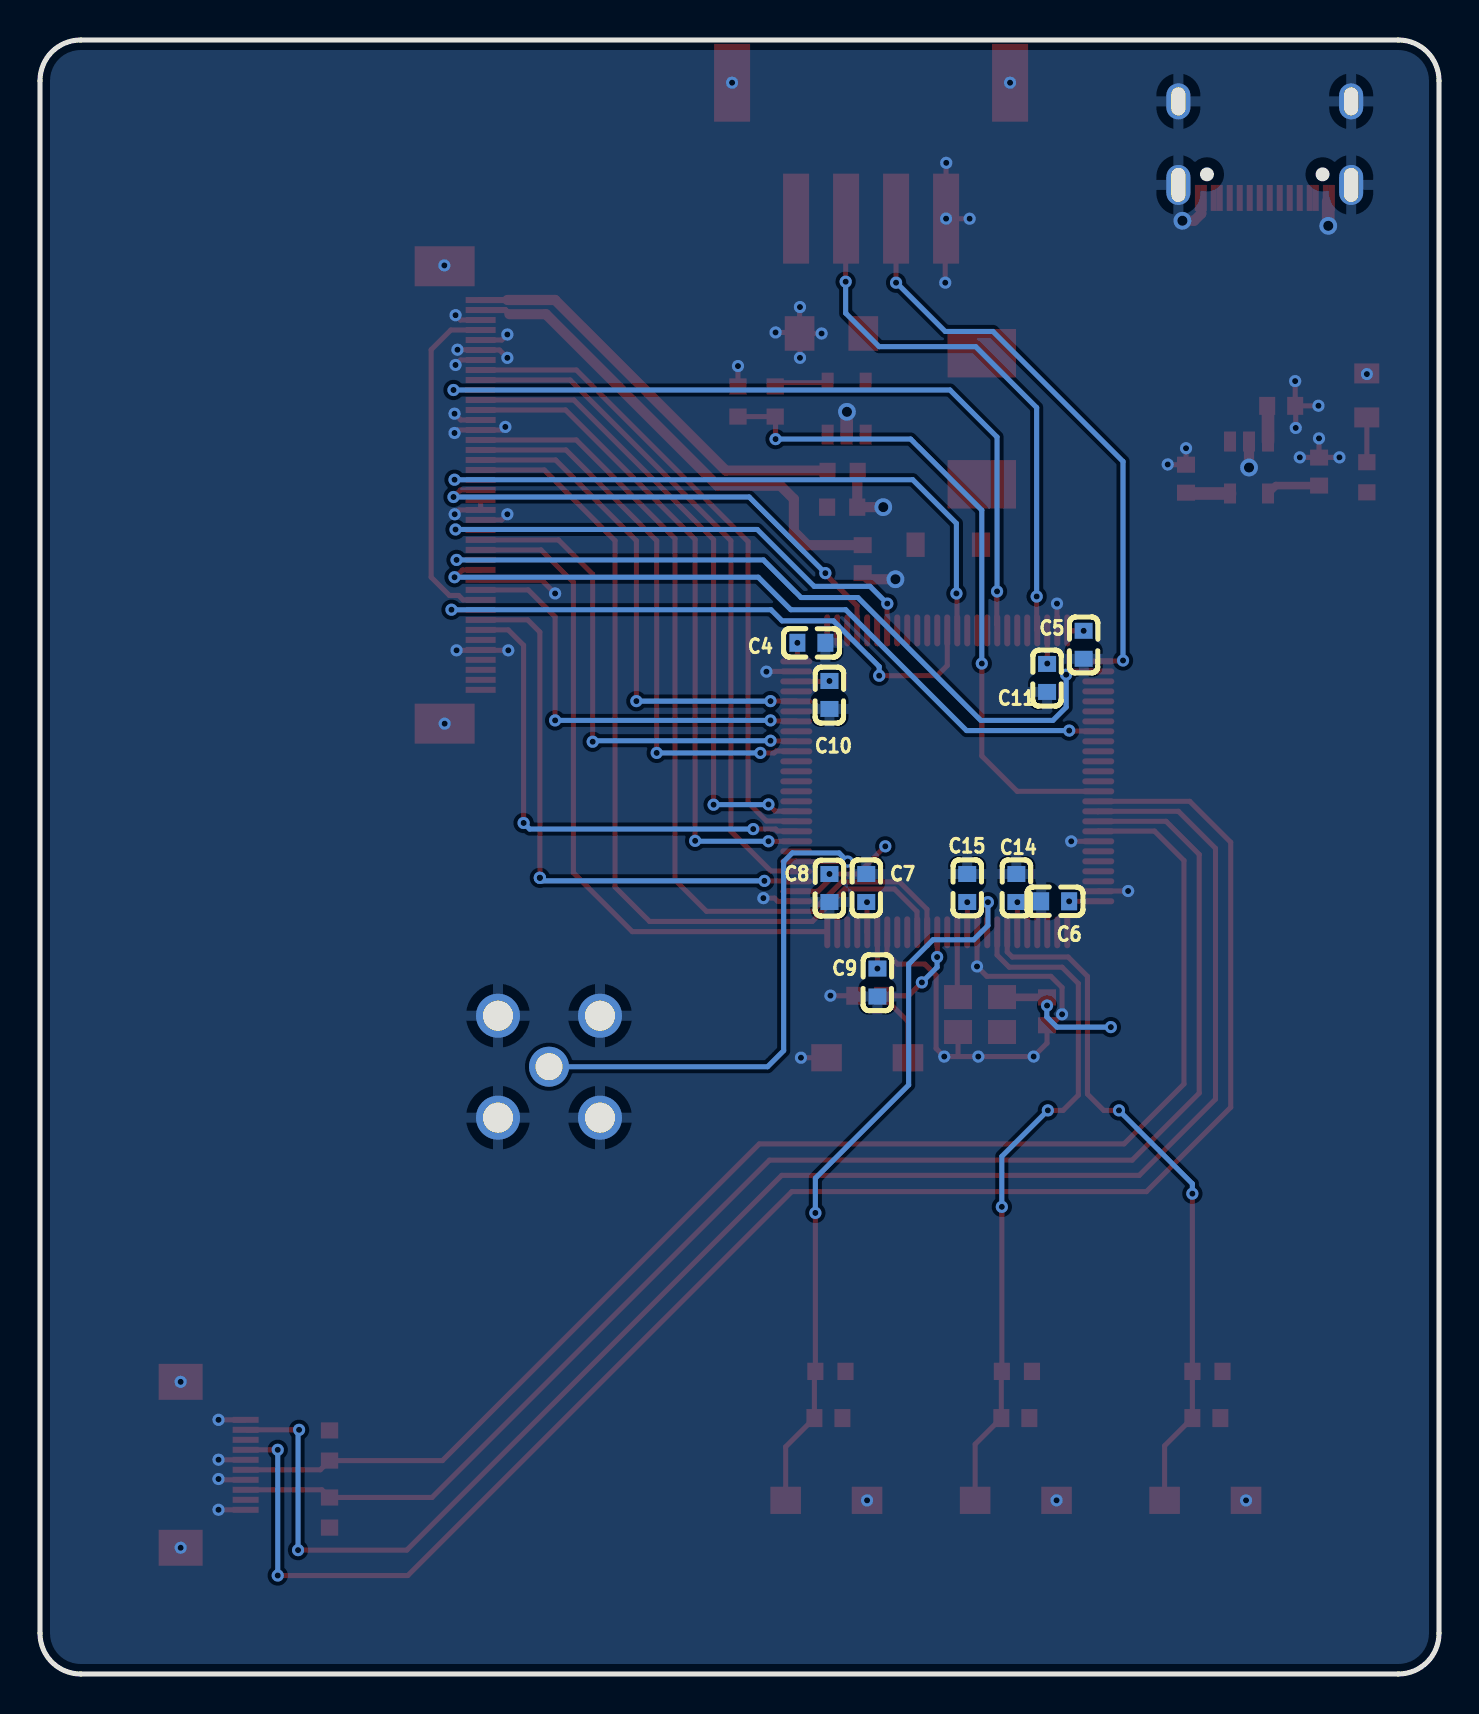
[diagram p5: board, bottom side, seen from below]

Outline 69.95 x 81.74 mm; copper layers: Top Layer, Bottom Layer. Coordinates in mm from the lower left corner of the outline.
Outline path: 0,79.7 0,2.03 arc(0.6,0.6) 2.03,0 67.92,0 arc(69.36,0.6) 69.95,2.03 69.95,79.7 arc(69.36,81.14) 67.92,81.74 2.03,81.74 arc(0.6,81.14) 0,79.7
Stack: Top Layer 0.035mm / Dielectric1 1.51mm FR4 er 4.5 / Bottom Layer 0.035mm

## Design rules (mm)
template: 自定义配置
spacing copperThickness1oz (default): track to track 0.102, other pairs 0.152 to 0.3
spacing copperThickness2oz: track to track 0.203, other pairs 0.152 to 0.3
track width copperThickness1oz (default): min 0.127, default 0.254, max 2.54
track width copperThickness2oz: min 0.203, default 0.254, max 2.54
differential pair differentialPair (default): width min 0.127, default 0.254, max 2.54; gap min 0.152, default 0.152
via viaSize (default): diameter min 0.5, default 0.61, max 10; hole min 0.3, default 0.305, max 6.299

## Placement (name value [footprint] x y rotation side)
ADC  BWSMA-KE-Z001  [SMA-TH_BWSMA-KE-Z001]  44.5 30.38 0 top
C4  100nF  [C0603]  31.38 51.58 0 bottom
C5  100nF  [C0603]  17.77 51.48 90 bottom
C6  100nF  [C0603]  19.19 38.65 180 bottom
C7  100nF  [C0603]  28.64 39.32 270 bottom
C8  100nF  [C0603]  30.48 39.32 90 bottom
C9  100nF  [C0603]  28.08 34.59 90 bottom
C10  100nF  [C0603]  30.48 48.97 90 bottom
C11  100nF  [C0603]  19.6 49.83 90 bottom
C12  100nF  [C0603]  28.54 33.93 180 top
C13  100nF  [C0603]  19.6 33.15 90 top
C14  100nF  [C0603]  21.13 39.32 270 bottom
C15  100nF  [C0603]  23.59 39.32 270 bottom
C16  100nF  [C0603]  7.89 63.43 0 top
C17  100nF  [C0603]  12.65 59.79 270 top
C18  100nF  [C0603]  5.99 60.15 270 top
C19  100nF  [C0603]  28.82 55.77 90 top
C21  100nF  [C0603]  11.63 12.8 180 top
C22  100nF  [C0603]  21.18 12.8 180 top
C23  100nF  [C0603]  30.53 12.8 180 top
C24  106  [C1206]  30.38 67.06 180 top
D1  MBR0520LT3G  [SOD-123_L2.7-W1.6-LS3.7-RD]  24.54 56.49 180 top
GND  HC-XH-4AWT  [CONN-SMD_HC-XH-4AWT]  28.4 76.2 180 top
L2  4.7uH  [IND-SMD_L7.3-W6.6]  22.86 62.79 90 top
PIN1  -  [Hirose_FH12-10S-0.5SH_1x10-1MP_P0.50mm_Horizontal]  61.52 10.47 90 top
PWR  -  [LED_0805]  3.61 63.91 270 top
R7  10K  [R0603]  3.61 59.86 90 top
R8  10K  [R0603]  55.47 8.08 90 top
R9  10K  [R0603]  55.47 11.43 270 top
R10  10K  [R0603]  35.05 63.65 270 top
R11  10K  [R0603]  29.82 60.16 0 top
R12  10K  [R0603]  29.84 58.37 0 top
R13  10K  [R0603]  33.19 63.65 90 top
R14  10K  [R0603]  11.58 15.14 180 top
R15  10K  [R0603]  21.11 15.14 180 top
R16  10K  [R0603]  30.43 15.14 180 top
RST  轻触按键3*4*H  [SW-SMD_L4.0-W2.9-LS5.0]  28.59 30.83 180 top
SW1  轻触按键3*4*H  [SW-SMD_L4.0-W2.9-LS5.0]  11.68 8.69 0 top
SW2  轻触按键3*4*H  [SW-SMD_L4.0-W2.9-LS5.0]  21.16 8.69 0 top
SW3  轻触按键3*4*H  [SW-SMD_L4.0-W2.9-LS5.0]  30.63 8.69 0 top
TO LCD  FPC-40贴片座子/间距0.5MM/上接/抽屉式  [FPC-SMD_40P-P0.50_FPC-40-2]  48.82 58.98 90 top
U6  STM32H7B0VBT6  [LQFP-100_L14.0-W14.0-P0.50-LS16.0-BL]  24.59 44.65 0 top
U7  RT9193-33GB  [SOT-23-5_L3.0-W1.7-P0.95-LS2.8-BR]  9.5 60.35 90 top
U8  MP3302DJ-LF-Z  [SOT-23-5_L3.0-W1.7-P0.95-LS2.8-BR]  29.62 63.3 270 top
USB1  -  [USB_TYPE-C-16P]  8.84 76.25 180 top
X1  25MHz  [OSC-SMD_4P-L3.2-W2.5-BL]  22.95 32.99 0 top

## Footprints (pads in the part's own frame, mm; a bottom-side part is the same pattern mirrored in y, then rotated)
C0603
  rect 0.8x0.9 smd: 1(-0.7,0) 2(0.7,0)
C1206
  rect 1.485x1.728 smd: 1(-1.593,0) 2(1.593,0)
CONN-SMD_HC-XH-4AWT
  rect 1.3x4.5 smd: 1(-3.75,3.4) 2(-1.25,3.4) 3(1.25,3.4) 4(3.75,3.4)
  rect 1.8x3.9 smd: 5(-6.95,-3.4) 6(6.95,-3.4)
FPC-SMD_40P-P0.50_FPC-40-2
  rect 0.3x1.5 smd: 1(-9.75,0.9) 2(-9.25,0.9) 3(-8.75,0.9) 4(-8.25,0.9) 5(-7.75,0.9) 6(-7.25,0.9) 7(-6.75,0.9) 8(-6.25,0.9) 9(-5.75,0.9) 10(-5.25,0.9) 11(-4.75,0.9) 12(-4.25,0.9) 13(-3.75,0.9) 14(-3.25,0.9) 15(-2.75,0.9) 16(-2.25,0.9) 17(-1.75,0.9) 18(-1.25,0.9) 19(-0.75,0.9) 20(-0.25,0.9) 21(0.25,0.9) 22(0.75,0.9) 23(1.25,0.9) 24(1.75,0.9) 25(2.25,0.9) 26(2.75,0.9) 27(3.25,0.9) 28(3.75,0.9) 29(4.25,0.9) 30(4.75,0.9) 31(5.25,0.9) 32(5.75,0.9) 33(6.25,0.9) 34(6.75,0.9) 35(7.25,0.9) 36(7.75,0.9) 37(8.25,0.9) 38(8.75,0.9) 39(9.25,0.9) 40(9.75,0.9)
  rect 2x3 smd: 41(11.44,-0.9) 42(-11.44,-0.9)
Hirose_FH12-10S-0.5SH_1x10-1MP_P0.50mm_Horizontal
  rect 0.3x1.3 smd: 1(-2.25,1.85) 2(-1.75,1.85) 3(-1.25,1.85) 4(-0.75,1.85) 5(-0.25,1.85) 6(0.25,1.85) 7(0.75,1.85) 8(1.25,1.85) 9(1.75,1.85) 10(2.25,1.85)
  rect 1.8x2.2 smd: MP(-4.15,-1.4) MP(4.15,-1.4)
IND-SMD_L7.3-W6.6
  rect 2.423x3.419 smd: 1(3.279,0) 2(-3.279,0)
LED_0805
  rect 1x1.25 smd: 1(-1.15,0.005) 2(1.05,0.005)
LQFP-100_L14.0-W14.0-P0.50-LS16.0-BL
  oval 0.3x1.6 smd: 1(-6,-7.55) 2(-5.5,-7.55) 3(-5,-7.55) 4(-4.5,-7.55) 5(-4,-7.55) 6(-3.5,-7.55) 7(-3,-7.55) 8(-2.5,-7.55) 9(-2,-7.55) 10(-1.5,-7.55) 11(-1,-7.55) 12(-0.5,-7.55) 13(0,-7.55) 14(0.5,-7.55) 15(1,-7.55) 16(1.5,-7.55) 17(2,-7.55) 18(2.5,-7.55) 19(3,-7.55) 20(3.5,-7.55) 21(4,-7.55) 22(4.5,-7.55) 23(5,-7.55) 24(5.5,-7.55) 25(6,-7.55) 51(6,7.55) 52(5.5,7.55) 53(5,7.55) 54(4.5,7.55) 55(4,7.55) 56(3.5,7.55) 57(3,7.55) 58(2.5,7.55) 59(2,7.55) 60(1.5,7.55) 61(1,7.55) 62(0.5,7.55) 63(0,7.55) 64(-0.5,7.55) 65(-1,7.55) 66(-1.5,7.55) 67(-2,7.55) 68(-2.5,7.55) 69(-3,7.55) 70(-3.5,7.55) 71(-4,7.55) 72(-4.5,7.55) 73(-5,7.55) 74(-5.5,7.55) 75(-6,7.55)
  oval 1.6x0.3 smd: 26(7.55,-6) 27(7.55,-5.5) 28(7.55,-5) 29(7.55,-4.5) 30(7.55,-4) 31(7.55,-3.5) 32(7.55,-3) 33(7.55,-2.5) 34(7.55,-2) 35(7.55,-1.5) 36(7.55,-1) 37(7.55,-0.5) 38(7.55,0) 39(7.55,0.5) 40(7.55,1) 41(7.55,1.5) 42(7.55,2) 43(7.55,2.5) 44(7.55,3) 45(7.55,3.5) 46(7.55,4) 47(7.55,4.5) 48(7.55,5) 49(7.55,5.5) 50(7.55,6) 76(-7.55,6) 77(-7.55,5.5) 78(-7.55,5) 79(-7.55,4.5) 80(-7.55,4) 81(-7.55,3.5) 82(-7.55,3) 83(-7.55,2.5) 84(-7.55,2) 85(-7.55,1.5) 86(-7.55,1) 87(-7.55,0.5) 88(-7.55,0) 89(-7.55,-0.5) 90(-7.55,-1) 91(-7.55,-1.5) 92(-7.55,-2) 93(-7.55,-2.5) 94(-7.55,-3) 95(-7.55,-3.5) 96(-7.55,-4) 97(-7.55,-4.5) 98(-7.55,-5) 99(-7.55,-5.5) 100(-7.55,-6)
OSC-SMD_4P-L3.2-W2.5-BL
  rect 1.4x1.2 smd: 1(-1.1,-0.875) 2(1.1,-0.875) 3(1.1,0.875) 4(-1.1,0.875)
R0603
  rect 0.806x0.864 smd: 1(-0.753,0) 2(0.753,0)
SMA-TH_BWSMA-KE-Z001
  round 2.2 hole 1.5: 1(-2.55,-2.55) 2(-2.55,2.55) 3(2.55,2.55) 4(2.55,-2.55)
  round 2 hole 1.35: 5(0,0)
SOD-123_L2.7-W1.6-LS3.7-RD
  rect 0.91x1.22 smd: 1(-1.635,0) 2(1.635,0)
SOT-23-5_L3.0-W1.7-P0.95-LS2.8-BR
  rect 1x0.6 smd: 1(1.3,-0.95) 2(1.3,0) 3(1.3,0.95) 4(-1.3,0.95) 5(-1.3,-0.95)
SW-SMD_L4.0-W2.9-LS5.0
  rect 1.53x1.36 smd: 1(-2.035,0) 2(2.035,0)
USB_TYPE-C-16P
  oval 1.2x2 hole 0.7x1.7: 1(-4.193,1.765) 2(4.447,1.765)
  oval 1.2x1.8 hole 0.7x1.4: 3(-4.193,-2.415) 4(4.447,-2.415)
  rect 0.3x1.3 smd: A1(-3.223,2.415) A4(-2.423,2.415) A5(-1.123,2.415) A6(-0.123,2.415) A7(0.377,2.415) A8(1.377,2.415) A9(2.677,2.415) A12(3.477,2.415) B1(3.177,2.415) B4(2.377,2.415) B5(1.877,2.415) B6(0.877,2.415) B7(-0.623,2.415) B8(-1.623,2.415) B9(-2.123,2.415) B12(-2.923,2.415)

## Nets
+3V3: C4.2 C5.2 C6.2 C7.2 C8.2 C9.2 C13.2 C14.2 C15.2 C17.2 C21.2 C22.2 C23.2 PIN1.2 R7.1 R8.1 R9.1 R14.2 R15.2 R16.2 TO LCD.10 TO LCD.37 U6.6 U6.11 U6.20 U6.21 U6.27 U6.50 U6.75 U6.100 U7.5 X1.4
+5V: C16.2 C24.2 L2.1 U7.1 U7.3 U8.5 USB1.A4 USB1.A9 USB1.B4 USB1.B9
GND: ADC.1 ADC.2 ADC.3 ADC.4 C4.1 C5.1 C6.1 C7.1 C8.1 C9.1 C10.1 C11.1 C12.1 C13.1 C14.1 C15.1 C16.1 C17.1 C18.1 C19.1 C24.1 GND.4 GND.5 GND.6 PIN1.1 PIN1.4 PIN1.6 PIN1.10 PIN1.MP PWR.1 R10.1 R11.1 R12.1 RST.1 SW1.1 SW2.1 SW3.1 TO LCD.5 TO LCD.12 TO LCD.18 TO LCD.19 TO LCD.20 TO LCD.27 TO LCD.28 TO LCD.34 TO LCD.35 TO LCD.36 TO LCD.38 TO LCD.41 TO LCD.42 U6.10 U6.19 U6.26 U6.49 U6.74 U6.94 U6.99 U7.2 U8.2 USB1.1 USB1.2 USB1.3 USB1.4 USB1.A1 USB1.A12 USB1.B1 USB1.B12 X1.2
VCC: GND.1
B3: TO LCD.17 U6.57
B4: TO LCD.16 U6.42
B5: TO LCD.15 U6.25
B6: TO LCD.14 U6.77
B7: TO LCD.13 U6.83
BL+: C19.2 D1.1 TO LCD.39
BL-: R11.2 R12.2 TO LCD.40 U8.3
CC1: USB1.A5
CC2: USB1.B5
G2: TO LCD.26 U6.15
G3: TO LCD.25 U6.41
G4: TO LCD.24 U6.46
G5: TO LCD.23 U6.16
G6: TO LCD.22 U6.64
G7: TO LCD.21 U6.54
LCD_BL: R10.2 R13.1 U6.89
LCD_CLK: TO LCD.11 U6.44
LCD_DE: TO LCD.7 U6.33
LCD_HS: TO LCD.9 U6.63
LCD_VS: TO LCD.8 U6.28
OCS_IN: U6.12 X1.3
PA0: U6.22
PA1: U6.23
PA2: U6.24
PA5: TO LCD.32 U6.29
PA6: ADC.5 U6.30
PA7: U6.31
PA8: U6.67
PA9: TO LCD.31 U6.68
PA10: U6.69
PA11: U6.70
PA12: U6.71
PB0: TO LCD.33 U6.34
PB1: TO LCD.30 U6.35
PB2: U6.36
PB4: PIN1.7 U6.90
PB5: PIN1.9 U6.91
PB6: PIN1.3 R8.2 U6.92
PB7: PIN1.5 R9.2 U6.93
PB8: U6.95
PB9: U6.96
PB11: U6.47
PB12: U6.51
PB13: U6.52
PB14: U6.53
PC2: U6.17
PC3: U6.18
PC4: TO LCD.29 U6.32
PC8: U6.65
PC9: U6.66
PC10: U6.78
PC11: U6.79
PC12: U6.80
PC13: C21.1 R14.1 SW1.2 U6.7
PC14: C22.1 R15.1 SW2.2 U6.8
PC15: C23.1 R16.1 SW3.2 U6.9
PD0: U6.81
PD1: U6.82
PD3: U6.84
PD4: U6.85
PD5: U6.86
PD6: U6.87
PD7: U6.88
PD8: U6.55
PD9: U6.56
PD11: U6.58
PD12: U6.59
PD13: U6.60
PD14: U6.61
PD15: U6.62
PE0: U6.97
PE1: U6.98
PE2: U6.1
PE3: U6.2
PE4: U6.3
PE5: U6.4
PE6: U6.5
PE7: U6.37
PE8: U6.38
PE9: U6.39
PE10: U6.40
PE13: U6.43
PE15: U6.45
PH1: U6.13
RST: C12.2 RST.2 U6.14
SWCLK: GND.3 U6.76
SWDIO: GND.2 U6.72
USB_N: USB1.A7 USB1.B7
USB_P: USB1.A6 USB1.B6
VCAP1: C10.2 U6.48
VCAP2: C11.2 U6.73
$1N2047: C18.2 U7.4
$1N2122: PWR.2 R7.2
$1N2420: D1.2 L2.2 U8.1
$1N2425: R13.2 U8.4

Pads without a net: PIN1 8; TO LCD 1 2 3 4 6; USB1 A8 B8; X1 1

## Via types
v1: diameter 0.61, hole 0.305, Top Layer to Bottom Layer, 119 vias
v2: diameter 0.889, hole 0.508, Top Layer to Bottom Layer, 6 vias

## Routing (per net, layer and track width the routed paths; a pad name or vN(x,y) marks a point on that pad's centre or on a via; arc(x,y) is an arc through that point)
+3V3: length 41.3
  Top Layer w0.254: 28.09,37.1 28.08,37.1 v1(28.08,35.29) ; v1(18.49,38.65) 18.49,38.65 U6.100 ; TO LCD.37 49.41,67.23 50.39,66.24 50.39,54.86 49.48,53.95 49.02,53.95 48.8,53.73 TO LCD.10 ; 28.59,37.1 28.6,37.12 v1(28.6,38.61) ; v1(27.69,41.4) 29.07,40.02 v1(30.48,40.02) 30.48,39.73 31.05,39.15 U6.27 ; v1(17.77,52.18) 18.57,52.18 U6.75 ; U6.50 32.08,50.71 v1(32.08,51.58) ; C13.2 19.6,33.44 v1(19.6,33.44) ; 23.59,37.1 v1(23.59,38.61) ; 21.08,38.66 v1(21.08,38.61) 21.08,37.11 21.09,37.1
  Top Layer w0.381: C13.2 21.84,33.85 X1.4
  Top Layer w0.635: U7.5 12.61,59.05 C17.2
  Bottom Layer w0.254: v1(23.59,38.61) 23.59,38.62 C15.2 ; v1(19.6,33.44) 19.61,33.43 19.61,32.87 19.1,32.36 v1(16.41,32.36)
+5V: length 1.8
  Top Layer w0.635: U7.3 8.55,63.39 C16.2
GND: length 92.4
  Top Layer w0.254: v1(7.16,62.33) 7.16,63.41 C16.1 ; v1(13.56,60.5) 13.55,60.49 C17.1 v1(12.65,61.32) ; 27.6,37.12 27.6,36.03 27.08,35.51 25.7,35.51 25.15,34.95 25.15,31.29 v1(24.74,30.89) 24.09,30.89 ; U6.99 17.02,39.17 v1(15.55,39.17) ; U6.26 33.06,38.65 33.22,38.81 v1(33.78,38.81) ; v1(6,61.81) 6,60.88 5.98,60.86 ; v1(24.65,72.8) 24.64,72.8 v1(23.47,72.8) ; v1(24.65,72.8) 24.69,72.76 v1(24.69,69.6) ; v1(24.65,72.8) 24.65,75.58 v1(24.64,75.59) ; 5.98,60.86 C18.1 ; 5.98,60.86 v1(4.98,60.86) ; 5.98,60.86 v1(6.96,60.86) ; C16.1 7.19,64.67 v1(7.19,64.67) ; C16.1 6.03,63.43 v1(6.03,63.44) ; U6.49 33.62,50.15 v1(33.63,50.14) ; TO LCD.38 48.93,67.73 v1(49.17,67.97) ; C24.1 31.95,67.04 v1(31.95,65.84) ; C24.1 31.97,68.36 v1(31.95,68.38) ; C24.1 v1(30.87,67.06) ; C24.1 32.02,67.11 v1(33.17,67.11) ; v1(35.05,65.43) R10.1 ; v1(46.58,67) 46.86,66.73 TO LCD.36 ; 23.1,37.12 v1(23.1,35.39) 22.61,34.9 19.41,34.9 18.85,34.34 v1(18.85,33) 19.4,32.45 C13.1 19.6,31.56 v1(20.27,30.89) v1(23.04,30.89) 24.09,30.89 ; U6.94 v1(18.39,41.65) ; PIN1.6 61.02,10.72 v1(61.03,10.72) ; 29.24,33.93 30.42,33.93 v1(30.43,33.93) ; X1.2 24.05,30.93 24.09,30.89 ; v1(46.58,65.84) 46.98,66.23 TO LCD.35 47.93,66.24 v1(49.08,66.24) ; v1(49.17,65.48) 48.93,65.73 TO LCD.34 ; v1(19.1,53.54) 19.1,52.22 U6.74 ; 47.9,51.21 v1(46.54,51.21) ; 47.9,51.21 TO LCD.5 ; 47.9,51.21 v1(49.12,51.21) ; v1(46.58,58.01) 46.87,57.73 TO LCD.18 ; RST.1 v1(31.9,30.83) ; v1(61.03,9.75) 60.99,9.72 PIN1.4 ; v1(49.23,63.04) 48.91,62.73 TO LCD.28 ; v1(49.22,58.01) 49,58.23 TO LCD.19 TO LCD.20 ; PIN1.10 v1(61.03,12.72) ; v1(61.03,8.22) PIN1.1 ; TO LCD.12 47.9,54.71 44.86,54.71 v1(44.2,54.05) ; v1(46.69,62.38) 46.84,62.23 TO LCD.27 49.07,62.23 v1(49.23,62.08)
  Top Layer w0.508: v2(27.79,58.37) R12.1 29.09,58.37 29.09,60.2 ; 11.89,73.71 11.89,73.05 12.24,72.7 v2(12.83,72.7) ; v2(27.18,54.76) 28.51,54.76 C19.1 ; v2(9.5,60.35) U7.2
  Top Layer w0.635: v2(29.6,63.14) 29.62,63.12 U8.2 ; 5.54,73.66 v2(5.54,72.44)
  vias: v1(3.61,65.02) v1(9.65,8.69) v1(19.12,8.69) v1(21.45,79.6) v1(28.6,8.69) v1(35.35,79.6) v1(49.73,70.46) v1(49.72,47.54) v1(62.92,14.62) v1(62.92,6.31)
B3: length 25.7
  Top Layer w0.254: v1(49.17,57.25) 47.94,57.25 TO LCD.17 ; v1(27.58,53.54) 27.6,53.53 27.6,52.22
  Bottom Layer w0.254: v1(49.17,57.25) 34.09,57.25 31.24,54.41 28.45,54.41 v1(27.58,53.54)
B4: length 24.9
  Top Layer w0.254: v1(42.32,46.63) 42.32,55.02 44.03,56.73 TO LCD.16 ; 32.15,46.67 33.41,46.67 v1(33.43,46.69)
  Bottom Layer w0.254: v1(33.43,46.69) 42.27,46.69 v1(42.32,46.63)
B5: length 33.7
  Top Layer w0.254: 30.61,37.14 40.33,37.14 43.28,40.08 43.28,54.61 44.9,56.23 TO LCD.15
B6: length 38.6
  Top Layer w0.254: 17.05,50.17 18.46,50.17 v1(18.64,49.99) ; TO LCD.14 v1(49.12,55.73)
  Bottom Layer w0.254: v1(49.12,55.73) 33.78,55.73 31.9,53.85 29.06,53.85 22.91,47.7 19.3,47.7 18.64,48.36 v1(18.64,49.99)
B7: length 36.8
  Top Layer w0.254: v1(49.23,54.86) 49.19,54.86 48.82,55.23 TO LCD.13 ; 17.05,47.17 18.47,47.17 v1(18.49,47.19)
  Bottom Layer w0.254: v1(18.49,47.19) 23.62,47.19 29.67,53.24 32.41,53.24 34.04,54.86 v1(49.23,54.86)
BL+: length 24.9
  Top Layer w0.305: 46.48,68.02 46.69,68.23 TO LCD.39
  Top Layer w0.508: C19.2 31.58,56.47 32.26,57.15 32.26,58.78 32.92,59.44 36.07,59.44 44.65,68.02 46.48,68.02
BL-: length 20.9
  Top Layer w0.305: TO LCD.40 46.59,68.73 46.58,68.73
  Top Layer w0.508: 30.6,60.2 35.66,60.2 44.2,68.73 46.58,68.73
G2: length 44.4
  Top Layer w0.254: TO LCD.26 43.14,61.73 38.2,56.79 38.2,39.73 36.63,38.15 31.33,38.15 29.86,39.62 26.98,39.62 25.6,38.25 25.6,37.12 25.6,37.12
G3: length 28.3
  Top Layer w0.254: 32.15,46.17 33.15,46.17 33.24,46.08 v1(33.93,46.08) ; v1(39.12,46.08) 39.12,56.69 43.65,61.23 TO LCD.25
  Bottom Layer w0.254: v1(39.12,46.08) v1(33.93,46.08)
G4: length 25.5
  Top Layer w0.254: TO LCD.24 44.17,60.73 40.13,56.69 v1(40.13,48.67) ; 32.15,48.67 32.16,48.67 v1(33.43,48.67)
  Bottom Layer w0.254: v1(33.43,48.67) v1(40.13,48.67)
G5: length 43.5
  Top Layer w0.254: TO LCD.23 44.73,60.23 41.2,56.69 41.2,39.37 39.47,37.64 31.34,37.64 29.71,39.27 27.23,39.27 26.1,38.14 26.1,37.12
G6: length 32.7
  Top Layer w0.254: v1(24.13,54.05) 24.1,54.02 24.1,52.22 ; v1(49.23,59.74) 47.93,59.74 TO LCD.22
  Bottom Layer w0.254: v1(24.13,54.05) 24.13,57.56 26.31,59.74 v1(49.23,59.74)
G7: length 25.2
  Top Layer w0.254: 29.1,52.22 29.1,53.43 30.68,55.02 v1(30.68,55.07) ; v1(49.28,58.88) 48.92,59.23 TO LCD.21
  Bottom Layer w0.254: v1(30.68,55.07) 34.49,58.88 v1(49.28,58.88)
LCD_BL: length 33.6
  Top Layer w0.254: U6.89 21.09,44.15 22.86,45.92 v1(22.86,50.55) ; v1(33.17,61.77) 33.17,62.88 R13.1 R10.2
  Bottom Layer w0.254: v1(22.86,50.55) 22.86,58.22 26.42,61.77 v1(33.17,61.77)
LCD_CLK: length 21.6
  Top Layer w0.254: v1(33.43,47.7) 33.4,47.67 32.15,47.67 ; TO LCD.11 45.54,54.23 44.2,52.88 v1(44.2,47.7)
  Bottom Layer w0.254: v1(33.43,47.7) 44.14,47.7 44.2,47.75 v1(44.2,47.7)
LCD_DE: length 25.1
  Top Layer w0.254: TO LCD.7 46.54,52.23 45.77,51.46 v1(45.77,42.57) ; 32.15,42.17 33.08,42.17 33.17,42.27 v1(34.29,42.27)
  Bottom Layer w0.254: v1(45.77,42.57) 45.47,42.27 v1(34.29,42.27)
LCD_HS: length 29.9
  Top Layer w0.254: TO LCD.9 49.37,53.23 v1(49.38,53.24) ; U6.63 24.59,50.44 25.1,49.94 v1(27.99,49.94)
  Bottom Layer w0.254: v1(49.38,53.24) 33.4,53.24 32.84,52.68 30.28,52.68 27.99,50.39 v1(27.99,49.94)
LCD_VS: length 28.4
  Top Layer w0.254: v1(44.96,39.83) 44.96,52.12 45.57,52.73 TO LCD.8 ; v1(33.73,39.67) 32.15,39.67 32.15,39.67
  Bottom Layer w0.254: v1(44.96,39.83) 44.81,39.67 v1(33.73,39.67)
OCS_IN: length 3.3
  Top Layer w0.254: 24.09,37.1 24.09,33.9 X1.3
PA5: length 34.5
  Top Layer w0.254: TO LCD.32 43.44,64.73 35.41,56.69 35.41,42.16 33.41,40.17 32.15,40.17
PA6: length 27.7
  Top Layer w0.254: v1(29.57,40.64) 32.12,40.64 U6.30
  Bottom Layer w0.254: 44.5,30.38 33.57,30.38 32.77,31.18 32.77,40.64 32.33,41.07 30,41.07 v1(29.57,40.64) 29.62,40.64
PA9: length 38.9
  Top Layer w0.254: v1(22.1,54.15) 22.11,54.15 22.11,52.5 22.09,52.47 ; TO LCD.31 v1(49.28,64.23)
  Bottom Layer w0.254: v1(49.28,64.23) 24.45,64.23 22.1,61.87 v1(22.1,54.15)
PB0: length 32.8
  Top Layer w0.254: 32.15,42.67 33.63,42.67 34.54,43.59 34.54,56.64 43.13,65.23 TO LCD.33
PB1: length 31.9
  Top Layer w0.254: 47.69,63.76 47.66,63.73 43.26,63.73 36.27,56.74 v1(36.27,43.48) ; v1(33.53,43.5) 33.19,43.16 32.08,43.16
  Bottom Layer w0.254: v1(33.53,43.5) 33.54,43.48 v1(36.27,43.48)
PB4: length 86
  Top Layer w0.254: PIN1.7 v1(58.06,11.22) ; v1(58.06,4.93) 51.56,4.93 32.36,24.13 14.63,24.13 10.41,28.35 10.41,41.61 12.46,43.65 U6.90
  Bottom Layer w0.254: v1(58.06,4.93) v1(58.06,11.22)
PB5: length 83.1
  Top Layer w0.254: PIN1.9 v1(57,12.22) ; v1(57.05,6.2) 51.61,6.2 32.87,24.94 14.99,24.94 11.18,28.75 11.18,41.3 13.03,43.15 U6.91 17.06,43.13
  Bottom Layer w0.254: v1(57.05,6.2) 57.05,12.16 v1(57,12.22)
PB6: length 73.9
  Top Layer w0.254: PIN1.3 55.86,9.22 R8.2 50.35,8.83 33.48,25.7 15.34,25.7 11.99,29.06 11.99,41 13.65,42.65 U6.92
PB7: length 71
  Top Layer w0.254: PIN1.5 55.94,10.22 R9.2 49.83,10.68 33.98,26.52 15.75,26.52 12.75,29.52 12.75,40.69 14.22,42.16 17.03,42.16 U6.93
PC4: length 33.2
  Top Layer w0.254: v1(37.19,41.68) 37.19,56.75 43.67,63.23 47.86,63.23 47.88,63.25 ; 32.49,41.66 32.5,41.66 v1(33.53,41.66)
  Bottom Layer w0.254: v1(37.19,41.68) 37.17,41.66 v1(33.53,41.66)
PC13: length 34.9
  Top Layer w0.254: 12.33,15.14 R14.1 ; 12.33,15.14 C21.1 13.72,11.42 SW1.2 ; 12.33,15.14 v1(12.33,24.03) ; 21.59,37.1 21.59,37.1 21.59,36.12 21.34,35.87 18.54,35.87 17.58,34.9 17.58,29.01 16.76,28.19 v1(16,28.19)
  Bottom Layer w0.254: v1(12.33,24.03) 12.33,24.53 v1(16,28.19)
PC14: length 34.2
  Top Layer w0.254: v1(21.86,23.37) R15.1 21.88,15.11 C22.1 23.19,11.49 SW2.2 ; 22.09,37.1 22.1,37.09 22.1,35.97 21.49,35.36 18.85,35.36 18.03,34.54 18.03,28.96 18.8,28.19 v1(19.56,28.19)
  Bottom Layer w0.254: v1(19.56,28.19) 21.86,25.89 v1(21.86,23.37)
PC15: length 36.9
  Top Layer w0.254: v1(22.55,38.61) 22.59,38.58 22.59,37.1 ; v1(31.18,23.06) R16.1 31.23,15.09 C23.1 32.67,11.37 SW3.2
  Bottom Layer w0.254: v1(22.55,38.61) 22.55,37.44 23.27,36.73 25.3,36.73 26.52,35.51 26.52,29.46 31.18,24.8 v1(31.18,23.06) 31.09,23.06
RST: length 8.7
  Top Layer w0.254: RST.2 26.55,32.64 C12.2 26.52,33.93 v1(25.86,34.59) ; v1(25.1,35.87) 25.09,35.87 25.09,37.1
  Bottom Layer w0.254: v1(25.86,34.59) 25.1,35.36 v1(25.1,35.87)
SWCLK: length 29.5
  Top Layer w0.254: v1(15.8,50.7) 15.82,50.67 17.02,50.67 U6.76 ; 27.15,72.8 v1(27.15,69.6)
  Bottom Layer w0.254: v1(27.15,69.6) 27.13,69.6 24.69,67.16 22.3,67.16 15.8,60.66 v1(15.8,50.7)
SWDIO: length 27.4
  Top Layer w0.254: v1(20.12,53.9) 20.12,52.23 U6.72 ; v1(29.67,69.65) 29.67,72.78 GND.2
  Bottom Layer w0.254: v1(20.12,53.9) 20.12,63.35 23.17,66.4 27.99,66.4 29.67,68.07 v1(29.67,69.65)
VCAP1: length 1.7
  Top Layer w0.254: v1(30.48,49.67) 30.49,49.67 30.53,49.63 30.55,49.65 U6.48
VCAP2: length 1.7
  Top Layer w0.254: U6.73 v1(19.59,50.55)
  Bottom Layer w0.254: C11.2 19.59,50.53 v1(19.59,50.55)
$1N2047: length 2.7
  Top Layer w0.381: C18.2 8.15,59.45 U7.4
$1N2122: length 2.2
  Top Layer w0.254: PWR.2 3.61,62.85 R7.2
$1N2425: length 2.7
  Top Layer w0.254: R13.2 33,64.6 U8.4

## Copper pours and planes (outline as drawn; the poured copper is in the pictures)
+3V3 on Top Layer: -0.41,81.23 71.37,81.23 71.37,-9.65 -0.41,-9.65
+5V on Top Layer: 6.05,72.9 5.89,73.05 5.89,75.27 6.37,75.74 10.93,75.74 11.48,75.18 11.48,72.44 15.24,68.68 29.36,68.68 30.07,67.97 30.07,65.84 29.57,65.33 29.57,64.01 29.01,63.45 13.01,63.45 11.58,62.03 11.58,60.66 11.33,60.4 10.31,60.4 10.01,60.71 10.01,62.18 9.61,62.58 8.28,62.58 7.77,63.09 7.77,64.77 8.89,65.89 10.26,65.89 11.43,67.06 11.43,70.1 10.72,70.81 10.72,74.47 10.62,74.57 6.81,74.57 6.71,74.47 6.71,73.05 6.55,72.9
GND on Bottom Layer: -0.1,81.84 71.37,81.84 71.37,-9.91 -0.1,-9.91
BL+ on Top Layer: 25.81,57.4 29.62,57.4 30.02,57 30.02,56.17 29.61,55.76 27.67,55.76 27.23,55.32 25.81,55.32 25.45,55.68 25.45,57.05
BL- on Top Layer: 29.87,57.11 30.85,57.11 31.09,57.35 31.09,62.23 30.89,62.43 29.87,62.43 29.67,62.23 29.67,57.32
$1N2420 on Top Layer: 22.43,62.79 28.85,62.79 29.11,62.53 29.11,61.32 28.8,61.01 25.96,61.01 25.1,60.15 25.1,56.03 24.49,55.42 21.44,55.42 20.83,56.03 20.83,61.18
